# EAGLE design batsim1_2 (EAGLE 7.7.0)
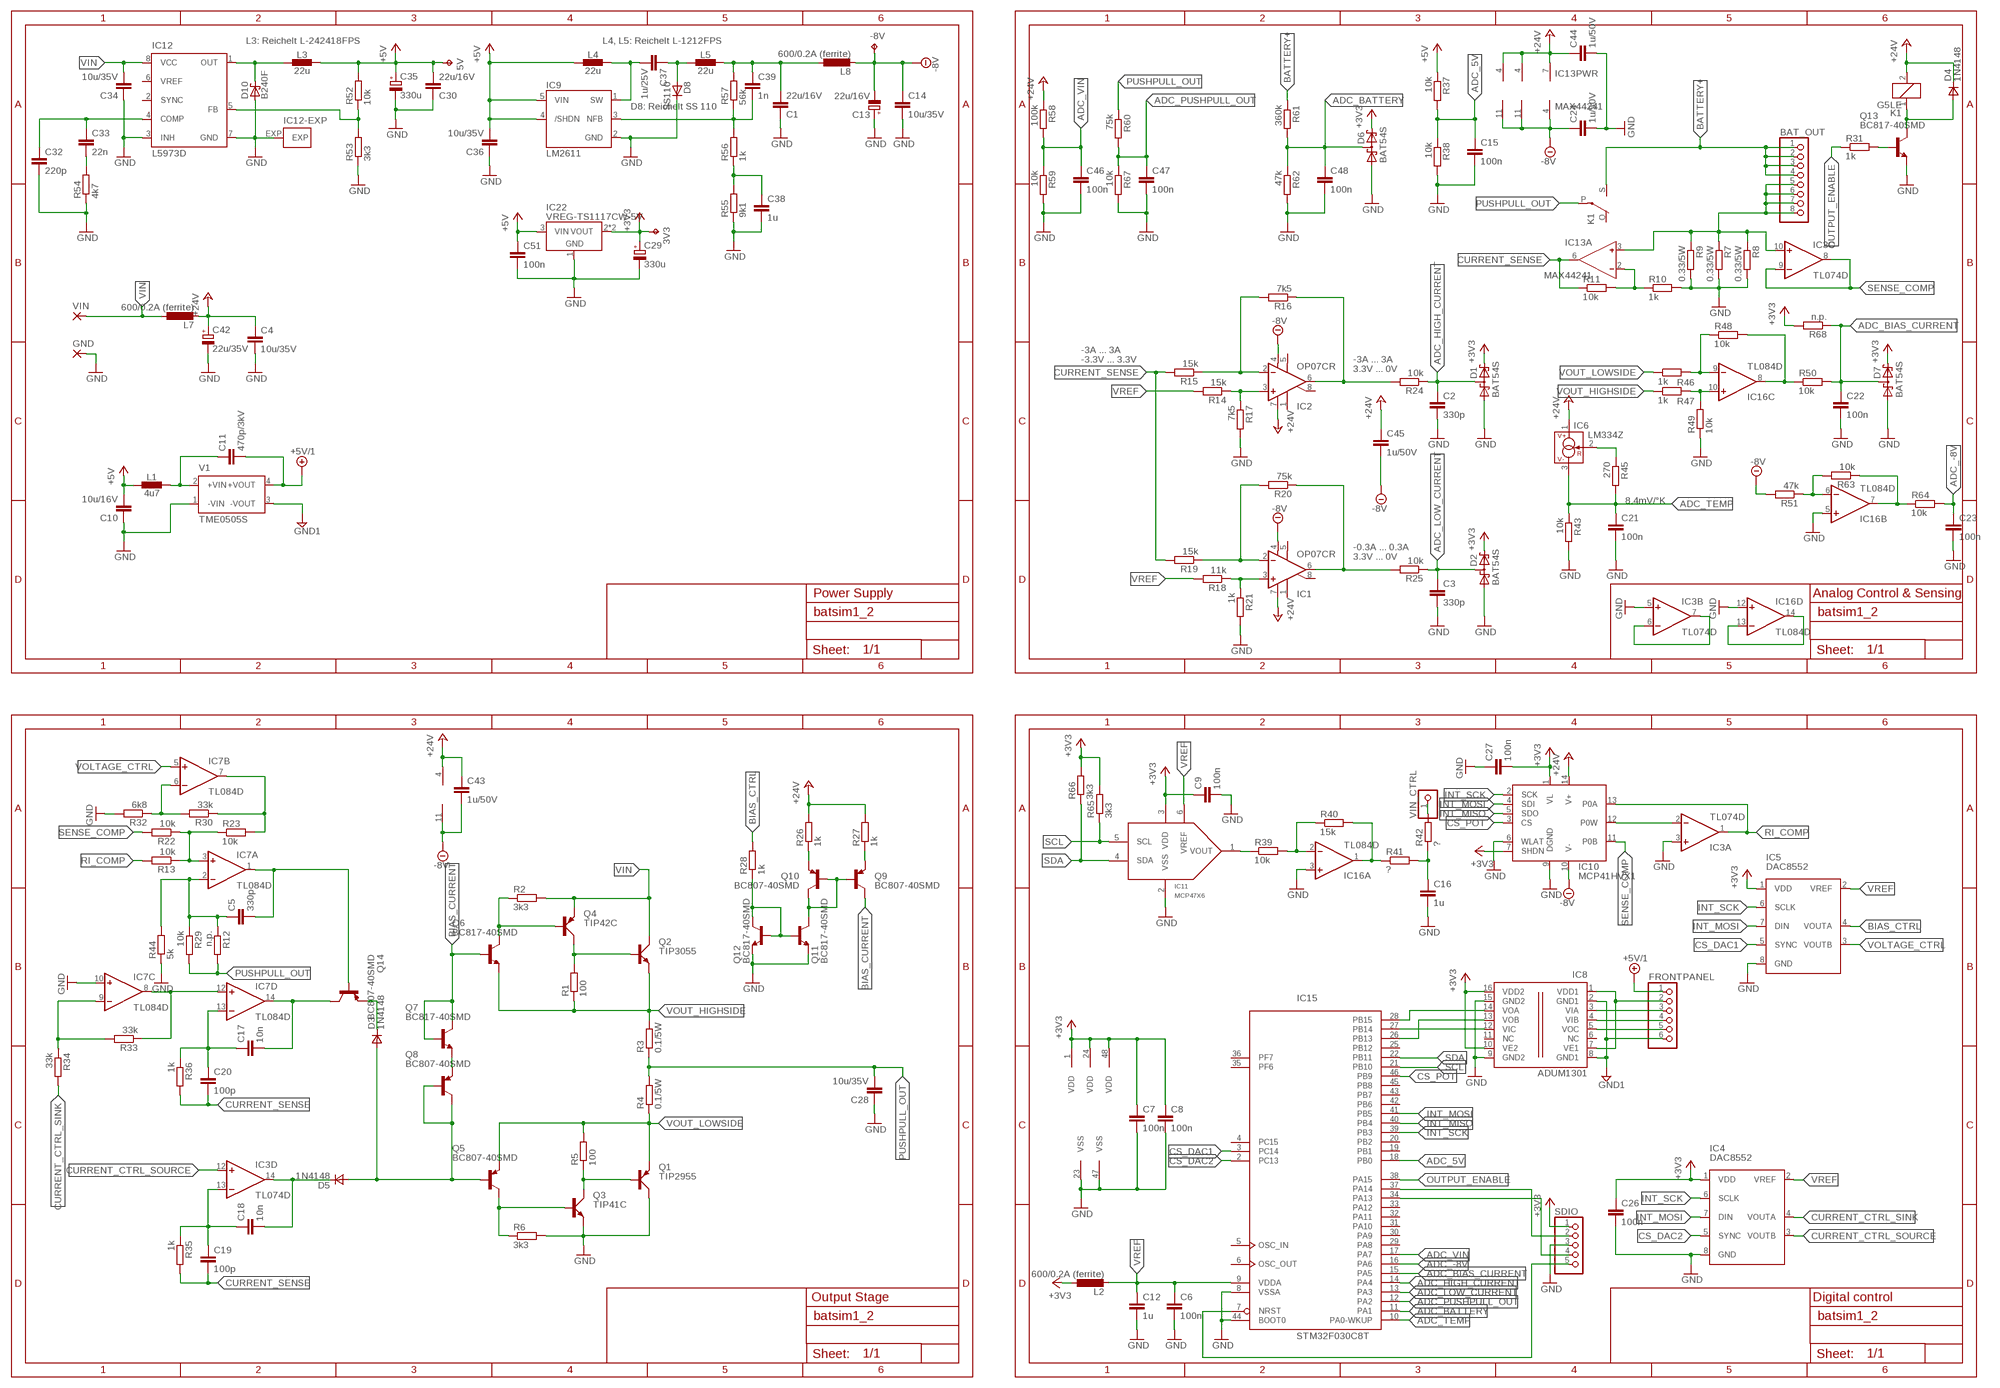
[diagram p0: schematic, sheet 1]

## Parts
3V3  TPB1,27  [B1,27]
5V  TPB1,27  [B1,27]
-8V  TPB1,27  [B1,27]
BAT_OUT  PINHD-1X8/90  [1X08/90]
C1  22u/16V  C-EUC1206  [C1206]
C2  330p  C-EUC0603  [C0603]
C3  330p  C-EUC0603  [C0603]
C4  10u/35V  C-EUC1206  [C1206]
C5  330p  C-EUC0603  [C0603]
C6  100n  C-EUC0603  [C0603]
C7  100n  C-EUC0603  [C0603]
C8  100n  C-EUC0603  [C0603]
C9  100n  C-EUC0603  [C0603]
C10  10u/16V  C-EUC1206  [C1206]
C11  470p/3kV  C-EUC1812  [C1812]
C12  1u  C-EUC0603  [C0603]
C13  22u/16V  CPOL-EU153CLV-0505  [153CLV-0505]
C14  10u/35V  C-EUC1206  [C1206]
C15  100n  C-EUC0603  [C0603]
C16  1u  C-EUC0603  [C0603]
C17  10n  C-EUC0603  [C0603]
C18  10n  C-EUC0603  [C0603]
C19  100p  C-EUC0603  [C0603]
C20  100p  C-EUC0603  [C0603]
C21  100n  C-EUC0603  [C0603]
C22  100n  C-EUC0603  [C0603]
C23  100n  C-EUC0603  [C0603]
C24  1u/50V  C-EUC0603  [C0603]
C26  100n  C-EUC0603  [C0603]
C27  100n  C-EUC0603  [C0603]
C28  10u/35V  C-EUC1206  [C1206]
C29  330u  CPOL-EU153CLV-0605  [153CLV-0605]
C30  22u/16V  C-EUC1206  [C1206]
C32  220p  C-EUC0603  [C0603]
C33  22n  C-EUC0603  [C0603]
C34  10u/35V  C-EUC1206  [C1206]
C35  330u  CPOL-EU153CLV-0605  [153CLV-0605]
C36  10u/35V  C-EUC1206  [C1206]
C37  1u/25V  C-EUC1206  [C1206]
C38  1u  C-EUC0603  [C0603]
C39  1n  C-EUC0603  [C0603]
C42  22u/35V  CPOL-EU153CLV-0605  [153CLV-0605]
C43  1u/50V  C-EUC0603  [C0603]
C44  1u/50V  C-EUC0603  [C0603]
C45  1u/50V  C-EUC0603  [C0603]
C46  100n  C-EUC0603  [C0603]
C47  100n  C-EUC0603  [C0603]
C48  100n  C-EUC0603  [C0603]
C51  100n  C-EUC0603  [C0603]
D1  BAT54S  [SOT23]
D2  BAT54S  [SOT23]
D3  1N4148  DSOD323  [SOD323]
D4  1N4148  DSOD323  [SOD323]
D5  1N4148  DSOD323  [SOD323]
D6  BAT54S  [SOT23]
D7  BAT54S  [SOT23]
D8  SS110  D-SMA  [SMA]
D10  B240F  SCHOTTKY-DIODESMD  [SMB]
FRONTPANEL  PINHD-1X6/90  [1X06/90]
GND  3,81/1,4  [3,81/1,4]
IC1  OP07CR  [SO08]
IC2  OP07CR  [SO08]
IC3  TL074D  [SO14]
IC4  DAC8552  [MSOP8]
IC5  DAC8552  [MSOP8]
IC6  LM334Z  [TO92]
IC7  TL084D  [SO14]
IC8  ADUM1301  [SO-16W]
IC9  LM2611  [SOT23-5]
IC10  MCP41HVX1  [TSSOP14]
IC11  MCP47X6  [SOT23-6L]
IC12  L5973D  [HSOP8]
IC13  MAX44241  [UMAX8]
IC15  STM32F030C8T  [LQFP48]
IC16  TL084D  [SO14]
IC22  VREG-TS1117CW-5V  [SOT223]
K1  G5LE  [G5LE]
L1  4u7  INDUCTOR-1212  [L_1212]
L2  600/0.2A (ferrite)  L-EUL2012C  [L2012C]
L3  22u  INDUCTOR-NR60XX  [L_NR60XX]
L4  22u  INDUCTOR-1212  [L_1212]
L5  22u  INDUCTOR-1212  [L_1212]
L7  600/0.2A (ferrite)  L-EUL2012C  [L2012C]
L8  600/0.2A (ferrite)  L-EUL2012C  [L2012C]
Q1  TIP2955  [TOP3AV]
Q2  TIP3055  [TOP3AV]
Q3  TIP41C  [TO220AV]
Q4  TIP42C  [TO220AV]
Q5  BC807-40SMD  [SOT23-BEC]
Q6  BC817-40SMD  [SOT23-BEC]
Q7  BC817-40SMD  [SOT23-BEC]
Q8  BC807-40SMD  [SOT23-BEC]
Q9  BC807-40SMD  [SOT23-BEC]
Q10  BC807-40SMD  [SOT23-BEC]
Q11  BC817-40SMD  [SOT23-BEC]
Q12  BC817-40SMD  [SOT23-BEC]
Q13  BC817-40SMD  [SOT23-BEC]
Q14  BC807-40SMD  [SOT23-BEC]
R1  100  R-EU_R0603  [R0603]
R2  3k3  R-EU_R0603  [R0603]
R3  0.1/5W  5WAXIAL  [5WAXIAL]
R4  0.1/5W  5WAXIAL  [5WAXIAL]
R5  100  R-EU_R0603  [R0603]
R6  3k3  R-EU_R0603  [R0603]
R7  0.33/5W  5WAXIAL  [5WAXIAL]
R8  0.33/5W  5WAXIAL  [5WAXIAL]
R9  0.33/5W  5WAXIAL  [5WAXIAL]
R10  1k  R-EU_R0603  [R0603]
R11  10k  R-EU_R0603  [R0603]
R12  n.p.  R-EU_R0603  [R0603]
R13  10k  R-EU_R0603  [R0603]
R14  15k  R-EU_R0603  [R0603]
R15  15k  R-EU_R0603  [R0603]
R16  7k5  R-EU_R0603  [R0603]
R17  7k5  R-EU_R0603  [R0603]
R18  11k  R-EU_R0603  [R0603]
R19  15k  R-EU_R0603  [R0603]
R20  75k  R-EU_R0603  [R0603]
R21  1k  R-EU_R0603  [R0603]
R22  10k  R-EU_R0603  [R0603]
R23  10k  R-EU_R0603  [R0603]
R24  10k  R-EU_R0603  [R0603]
R25  10k  R-EU_R0603  [R0603]
R26  1k  R-EU_R0603  [R0603]
R27  1k  R-EU_R0603  [R0603]
R28  1k  R-EU_R0603  [R0603]
R29  10k  R-EU_R0603  [R0603]
R30  33k  R-EU_R0603  [R0603]
R31  1k  R-EU_R0603  [R0603]
R32  6k8  R-EU_R0603  [R0603]
R33  33k  R-EU_R0603  [R0603]
R34  33k  R-EU_R0603  [R0603]
R35  1k  R-EU_R0603  [R0603]
R36  1k  R-EU_R0603  [R0603]
R37  10k  R-EU_R0603  [R0603]
R38  10k  R-EU_R0603  [R0603]
R39  10k  R-EU_R0603  [R0603]
R40  15k  R-EU_R0603  [R0603]
R41  ?  R-EU_R0603  [R0603]
R42  ?  R-EU_R0603  [R0603]
R43  10k  R-EU_R0603  [R0603]
R44  5k  R-EU_R0603  [R0603]
R45  270  R-EU_R0603  [R0603]
R46  1k  R-EU_R0603  [R0603]
R47  1k  R-EU_R0603  [R0603]
R48  10k  R-EU_R0603  [R0603]
R49  10k  R-EU_R0603  [R0603]
R50  10k  R-EU_R0603  [R0603]
R51  47k  R-EU_R0603  [R0603]
R52  10k  R-EU_R0603  [R0603]
R53  3k3  R-EU_R0603  [R0603]
R54  4k7  R-EU_R0603  [R0603]
R55  9k1  R-EU_R0603  [R0603]
R56  1k  R-EU_R0603  [R0603]
R57  56k  R-EU_R0603  [R0603]
R58  100k  R-EU_R0603  [R0603]
R59  10k  R-EU_R0603  [R0603]
R60  75k  R-EU_R0603  [R0603]
R61  360k  R-EU_R0603  [R0603]
R62  47k  R-EU_R0603  [R0603]
R63  10k  R-EU_R0603  [R0603]
R64  10k  R-EU_R0603  [R0603]
R65  3k3  R-EU_R0603  [R0603]
R66  3k3  R-EU_R0603  [R0603]
R67  10k  R-EU_R0603  [R0603]
R68  n.p.  R-EU_R0603  [R0603]
SDIO  PINHD-1X5  [1X05]
V1  TME0505S  [TME]
VIN  3,81/1,4  [3,81/1,4]
VIN_CTRL  PINHD-1X1  [1X01]

## Nets
+3V3: 3V3.TP C7.1 C8.1 C9.1 C26.1 C27.2 C29.+ D1.2(C2) D2.2(C2) D6.2(C2) D7.2(C2) IC4.1(VDD) IC5.1(VDD) IC8.10(VE2) IC8.16(VDD2) IC10.1(VL) IC10.7(SHDN) IC11.3(VDD) IC15.1(VDD) IC15.24(VDD) IC15.48(VDD) IC22.2(VOUT) IC22.4(VOUT) L2.1 R65.2 R66.2 R68.2 SDIO.1
+5V: 5V.TP C10.2 C30.2 C35.+ C36.2 C51.1 IC9.4(/SHDN) IC9.5(VIN) IC22.3(VIN) L1.1 L3.2 L4.1 R37.1 R52.2
+5V/1: C11.2 FRONTPANEL.1 V1.4(+VOUT)
+24V: C4.1 C42.+ C43.1 C44.1 C45.1 D4.1(C) IC1.7(V+) IC2.7(V+) IC3.4(P:V+) IC6.1(V+) IC7.4(P:V+) IC10.14(V+) IC13.7(PWR:V+) IC16.4(P:V+) K1.2 L7.2 R26.2 R27.2 R58.1
-8V: -8V.TP C13.- C14.1 C24.1 C43.2 C45.2 IC1.4(V-) IC2.4(V-) IC3.11(P:V-) IC7.11(P:V-) IC10.10(V-) IC13.4(PWR:V-) IC16.11(P:V-) L8.2 R51.2
ADC_5V: C15.1 IC15.18(PB0) R37.2 R38.1
ADC_-8V: C23.1 IC15.16(PA6) R64.2
ADC_BATTERY: C48.1 D6.3(C1A2) IC15.11(PA1) R61.2 R62.1
ADC_BIAS_CURRENT: C22.1 D7.3(C1A2) IC15.15(PA5) R50.2 R68.1
ADC_HIGH_CURRENT: C2.1 D1.3(C1A2) IC15.14(PA4) R24.1
ADC_LOW_CURRENT: C3.1 D2.3(C1A2) IC15.13(PA3) R25.1
ADC_PUSHPULL_OUT: C47.1 IC15.12(PA2) R60.2 R67.1
ADC_TEMP: C21.1 IC6.3(V-) IC15.10(PA0-WKUP) R43.1 R45.2
ADC_VIN: C46.1 IC15.17(PA7) R58.2 R59.1
BATTERY+: BAT_OUT.1 BAT_OUT.2 BAT_OUT.3 BAT_OUT.4 K1.S(2:S) R61.1
BIAS_CTRL: IC5.4(VOUTA) R28.2
BIAS_CURRENT: Q6.B Q7.B Q7.C Q9.C
CS_DAC1: IC5.5(SYNC) IC15.3(PC14)
CS_DAC2: IC4.5(SYNC) IC15.2(PC13)
CS_POT: IC10.3(CS) IC15.46(PB9)
CURRENT_CTRL_SINK: IC4.4(VOUTA) R34.2
CURRENT_CTRL_SOURCE: IC3.12(D:+IN) IC4.3(VOUTB)
CURRENT_SENSE: C19.2 C20.2 IC13.6(A:OUT) R11.1 R15.2 R19.2 R35.2 R36.2
EXT_MISO: IC8.12(VIC) IC15.27(PB14)
EXT_MOSI: IC8.14(VOA) IC15.28(PB15)
EXT_SCK: IC8.13(VOB) IC15.26(PB13)
GND: C1.1 C2.2 C3.2 C4.2 C6.2 C7.2 C8.2 C9.2 C10.1 C12.2 C13.+ C14.2 C15.2 C16.2 C21.2 C22.2 C23.2 C24.2 C26.2 C27.1 C28.1 C29.- C30.1 C32.2 C34.1 C35.- C36.1 C38.2 C42.- C44.2 C46.2 C47.2 C48.2 C51.2 D1.1(A1) D2.1(A1) D6.1(A1) D7.1(A1) D8.C D10.A GND.1(P) IC3.3(A:+IN) IC3.5(B:+IN) IC4.8(GND) IC5.8(GND) IC7.10(C:+IN) IC8.9(GND2) IC8.15(GND2) IC9.2(GND) IC10.6(WLAT) IC10.9(DGND) IC11.2(VSS) IC12.3(INH) IC12.7(GND) IC12.EXP IC15.8(VSSA) IC15.23(VSS) IC15.44(BOOT0) IC15.47(VSS) IC16.3(A:+IN) IC16.5(B:+IN) IC16.12(D:+IN) IC22.1(GND) Q1.C Q3.E Q11.E Q12.E Q13.E R6.2 R7.2 R8.2 R9.2 R10.2 R17.2 R21.2 R32.2 R38.2 R43.2 R44.1 R49.1 R53.1 R54.1 R55.1 R59.2 R62.2 R67.2 SDIO.3 V1.1(-VIN)
GND1: FRONTPANEL.6 IC8.2(GND1) IC8.8(GND1) V1.3(-VOUT)
INT_MISO: IC10.5(SDO) IC15.40(PB4)
INT_MOSI: IC4.7(DIN) IC5.7(DIN) IC10.4(SDI) IC15.41(PB5)
INT_SCK: IC4.6(SCLK) IC5.6(SCLK) IC10.2(SCK) IC15.39(PB3)
LM2611_SW: C37.2 IC9.1(SW) L4.2
N$1: IC7.3(A:+IN) R13.1 R22.1 R23.1
N$2: Q2.B Q4.C R1.2
N$3: Q4.B Q6.C R2.1
N$4: IC7.6(B:-IN) R30.2 R32.1
N$5: BAT_OUT.5 BAT_OUT.6 BAT_OUT.7 BAT_OUT.8 IC3.10(C:+IN) IC13.3(A:IN+) R7.1 R8.1 R9.1
N$6: IC16.9(C:-IN) R46.2 R48.1
N$7: Q1.B Q3.C R5.1
N$8: C11.1 L1.2 V1.2(+VIN)
N$9: Q3.B Q5.C R6.1
N$10: Q7.E Q8.E
N$11: IC7.7(B:OUT) R23.2 R30.1
N$12: D3.1(C) Q14.E
N$13: D4.2(A) K1.1 Q13.C
N$14: IC13.2(A:IN-) R10.1 R11.2
N$15: IC3.6(B:-IN) IC3.7(B:OUT)
N$16: IC2.3(+IN) R14.1 R17.1
N$17: IC2.2(-IN) R15.1 R16.2
N$18: IC2.6(OUT) R16.1 R24.2
N$20: IC1.3(+IN) R18.1 R21.1
N$21: IC1.2(-IN) R19.1 R20.2
N$22: IC1.6(OUT) R20.1 R25.2
N$23: IC3.2(A:-IN) IC10.12(P0W)
N$24: Q9.B Q10.B Q10.C Q11.C
N$25: Q11.B Q12.B Q12.C R28.1
N$26: Q13.B R31.2
N$27: IC16.13(D:-IN) IC16.14(D:OUT)
N$28: Q10.E R26.1
N$29: Q9.E R27.1
N$30: C32.1 C33.1 IC12.4(COMP)
N$31: C5.2 IC7.1(A:OUT) Q14.B
N$35: IC11.1(VOUT) R39.1
N$36: IC7.9(C:-IN) R33.2 R34.1
N$37: IC7.8(C:OUT) IC7.12(D:+IN) R33.1
N$38: C18.2 D5.1(C) IC3.14(D:OUT)
N$39: C18.1 C19.1 IC3.13(D:-IN) R35.1
N$40: C17.2 IC7.14(D:OUT) Q14.C
N$41: IC16.2(A:-IN) R39.2 R40.1
N$42: C17.1 C20.1 IC7.13(D:-IN) R36.1
N$43: IC16.1(A:OUT) R40.2 R41.1
N$44: C16.1 R41.2 R42.1
N$45: FRONTPANEL.2 IC8.1(VDD1) IC8.7(VE1)
N$46: FRONTPANEL.3 IC8.3(VIA)
N$47: FRONTPANEL.4 IC8.4(VIB)
N$48: FRONTPANEL.5 IC8.5(VOC)
N$49: C33.2 R54.2
N$50: IC16.10(C:+IN) R47.2 R49.2
N$51: IC6.2(R) R45.1
N$52: D10.C IC12.1(OUT) L3.1
N$53: C1.2 C39.1 L5.2 L8.1 R57.2
N$54: IC12.5(FB) R52.1 R53.2
N$55: IC16.8(C:OUT) R48.2 R50.1
N$56: C37.1 D8.A L5.1
N$57: C39.2 IC9.3(NFB) R56.2 R57.1
N$58: C38.1 R55.2 R56.1
N$59: IC16.6(B:-IN) R51.1 R63.2
N$60: IC16.7(B:OUT) R63.1 R64.1
NRST: IC15.7(NRST) SDIO.5
OUTPUT_ENABLE: IC15.38(PA15) R31.1
PUSHPULL_CTRL: D3.2(A) D5.2(A) Q5.B Q8.B Q8.C
PUSHPULL_OUT: C28.2 K1.P(2:P) R3.1 R4.2 R12.2 R29.2 R60.1
RI_COMP: IC3.1(A:OUT) IC10.13(P0A) R13.2
SCL: IC11.5(SCL) IC15.21(PB10) R65.1
SDA: IC11.4(SDA) IC15.22(PB11) R66.1
SENSE_COMP: IC3.8(C:OUT) IC3.9(C:-IN) IC10.11(P0B) R22.2
SWCLK: IC15.37(PA14) SDIO.2
SWDIO: IC15.34(PA13) SDIO.4
VIN: C34.2 IC12.8(VCC) L7.1 Q2.C Q4.E R2.2 VIN.1(P)
VIN_CTRL: R42.2 VIN_CTRL.1
VOLTAGE_CTRL: IC5.3(VOUTB) IC7.5(B:+IN)
VOLTAGE_FEEDBACK: C5.1 IC7.2(A:-IN) R12.1 R29.1 R44.2
VOUT_HIGHSIDE: Q2.E Q6.E R1.1 R3.2 R47.1
VOUT_LOWSIDE: Q1.E Q5.E R4.1 R5.2 R46.1
VREF: C6.1 C12.1 IC4.2(VREF) IC5.2(VREF) IC11.6(VREF) IC15.9(VDDA) L2.2 R14.2 R18.2
Unconnected: IC1.1(ON1) IC1.5(OPT) IC1.8(ON2) IC2.1(ON1) IC2.5(OPT) IC2.8(ON2) IC8.6(NC) IC8.11(NC) IC12.2(SYNC) IC12.6(VREF) IC15.4(PC15) IC15.5(OSC_IN) IC15.6(OSC_OUT) IC15.19(PB1) IC15.20(PB2) IC15.25(PB12) IC15.29(PA8) IC15.30(PA9) IC15.31(PA10) IC15.32(PA11) IC15.33(PA12) IC15.35(PF6) IC15.36(PF7) IC15.42(PB6) IC15.43(PB7) IC15.45(PB8) K1.O(2:O)

## Notes on the sheet
- L3: Reichelt L-242418FPS | L4, L5: Reichelt L-1212FPS
- D8: Reichelt SS 110
- -3A ... 3A
  -3.3V ... 3.3V
- -3A ... 3A
  3.3V ... 0V
- 8.4mV/°K
- -0.3A ... 0.3A
  3.3V ... 0V
- Power Supply | Analog Control & Sensing
- Output Stage | Digital control

## Library data of the parts
3V3 5V -8V = testpad:TP: Test pad
BAT_OUT = pinhead:PINHD-1X8: PIN HEADER
C1-C10 C12 C14-C24 C26-C28 C30 C32-C34 C36-C39 C43-C48 C51 = rcl:C-EU: CAPACITOR, European symbol
C11 = resistor:C-EU: CAPACITOR, European symbol
C13 C29 C35 C42 = resistor:CPOL-EU: POLARIZED CAPACITOR, European symbol
D1 D2 D6 D7 = diode:BAT54S: Schottky Diodes Pin connection corrected 2011-05-04 Source: Fairchild .. BAT54.pdf
D3-D5 = zetex:D: DIODE; MPN: CDSOD323-T05C; OC_FARNELL: 1824860; OC_NEWARK: 79R6078
D8 = diodes:D-: DIODE
D10 = diode:SCHOTTKY-DIODE: Schottky Diode
FRONTPANEL = pinhead:PINHD-1X6: PIN HEADER
GND VIN = wirepad:3,81/1,4: THROUGH-HOLE PAD
IC1 IC2 = linear:OP07*: OP AMP
IC3 = linear:TL074: OP AMP
IC4 IC5 = dac:DAC8552
IC6 = linear:LM*34: 3-Terminal Adjustable Current Sources Source: www.national.com/pf/LM/LM334.html | LM134.pdf
IC7 IC16 = linear:TL084: OP AMP
IC8 = analog-devices:ADUM1301: Triple-Channel Digital Isolators Source: http://www.analog.com/static/imported-files/data_sheets/ADuM1300_1301.pdf; MPN: ADUM1301BRWZ; OC_FARNELL: 1465623; OC_NEWARK: 19M0757
IC9 = v-reg-3:LM2611
IC10 = mcp:MCP41HVX1
IC11 = dac:MCP47X6
IC12 = st-microelectronics:L5973D: 2.5 A switch step down switching regulator Source: Data sheet <http://www.st.com/internet/com/TECHNICAL_RESOURCES/TECHNICAL_LITERATURE/DATASHEET/CD00002851.pdf>; MF: STMICROELECTRONICS; MPN: L5973D; OC_FARNELL: 1077145
IC13 = custom-op:MAX44241
IC15 = micro-stm_v3:STM32F030C*T: ARM 32-bit Cortex™-M0 CPU 48 MHz maximum frequency 32 to 64 Kbytes of Flash memory 4 to 8 kbytes of SRAM 39 GPIOs 2.4 to 3.6 V application supply
IC22 = we-power:VREG: Voltage Regulators (LDOs, Switching Converters...) LDOs Taiwan Semi TS1117 800mA max 15V - compatible On Semi NCP1117 1A max 20V - compatible Diodes AP2111H 0.6A max 6V (0.25V@0.6A) - compatible Diodes AP2114H 1A max 6V (0.45V@1A) Taiwan Semi TS9011 250mA max 12V - compatible Diodes AP2210 300mA max 15V - compatible Microchip MCP1700 250mA max 6.5V - compatible Microchip MCP1702 250mA max 13V - compatible Microchip MCP1703 250mA max 16V - compatible Microchip MCP1754 150mA max 16V Taiwan Semi TS5204 150mA max 16V (low noise) DC/DC Converter Modules Recom R-78Ex.x-1.0-W36 1A max 28V - compatible CUI V78xx-2000 2A max 18V Murata OKI-78SR-x.x/1.5-W36 1.5A max 36V
K1 = relay:G5LE: RELAY 1 x switch, 10 A/120 V AC, 8 A/30 V DC, Omron; OC_FARNELL: unknown; OC_NEWARK: unknown
L1 L3-L5 = we-power:INDUCTOR: Power Inductors Taiyo Yuden NR6028 NR6028T0R9N - 0.9uH, Ir=6.6A NR6028T1R5N - 1.5uH, Ir=5.0A NR6028T2R2N - 2.2uH, Ir=4.2A NR6028T3R0N - 3.0uH, Ir=3.6A NR6028T4R7M - 4.7uH, Ir=2.7A NR6028T6R0M - 6.0uH, Ir=2.5A NR6028T100M - 10uH, Ir=1.9A NR6028T150M - 15uH, Ir=1.6A NR6028T220M - 22uH, Ir=1.3A NR6028T330M - 33uH, Ir=1.1A NR6028T470M - 47uH, Ir=0.95A NR6028T680M - 68uH, Ir=0.76A NR6028T101M - 100uH, Ir=0.62A Taiyo Yuden NR6045 NR6045T1R0N - 1.0uH, Ir=8.5A NR6045T1R3N - 1.3uH, Ir=8.0A NR6045T1R8N - 1.8uH, Ir=7.0A NR6045T2R3N - 2.3uH, Ir=6.0A NR6045T3R0N - 3.0uH, Ir=5.0A NR6045T4R5M - 4.5uH, Ir=4.0A NR6045T6R3M - 6.3uH, Ir=3.8A NR6045T100M - 10uH, Ir=3.0A NR6045T150M - 15uH, Ir=2.3A NR6045T220M - 22uH, Ir=1.9A NR6045T330M - 33uH, Ir=1.5A NR6045T470M - 47uH, Ir=1.3A NR6045T680M - 68uH, Ir=1.0A NR6045T101M - 100uH, Ir=0.8A
L2 L7 L8 = rcl:L-EU: INDUCTOR, European symbol
Q1 = transistor-power:TIP2955: PNP TRANSISTOR
Q2 = transistor-power:TIP3055: NPN TRANSISTOR
Q3 = transistor-power:TIP41C: NPN TRANSISTOR
Q4 = transistor-power:TIP42C: PNP TRANSISTOR
Q5 Q8-Q10 Q14 = transistor-pnp:BC807*: PNP Transistror
Q6 Q7 Q11-Q13 = transistor-npn:BC817*: NPN Transistor
R1 R2 R5 R6 R10-R68 = resistor:R-EU_: RESISTOR, European symbol
R3 R4 R7-R9 = resistormod:5WAXIAL
SDIO = pinhead:PINHD-1X5: PIN HEADER
V1 = traco-electronic:TME?*: DC/DC Converter TME Series 1 Watt Source: www.tracopower.com .. tme.pdf; MPN: TME 0505S; OC_FARNELL: 1007538; OC_NEWARK: 51R5321
VIN_CTRL = pinhead:PINHD-1X1: PIN HEADER

## Board
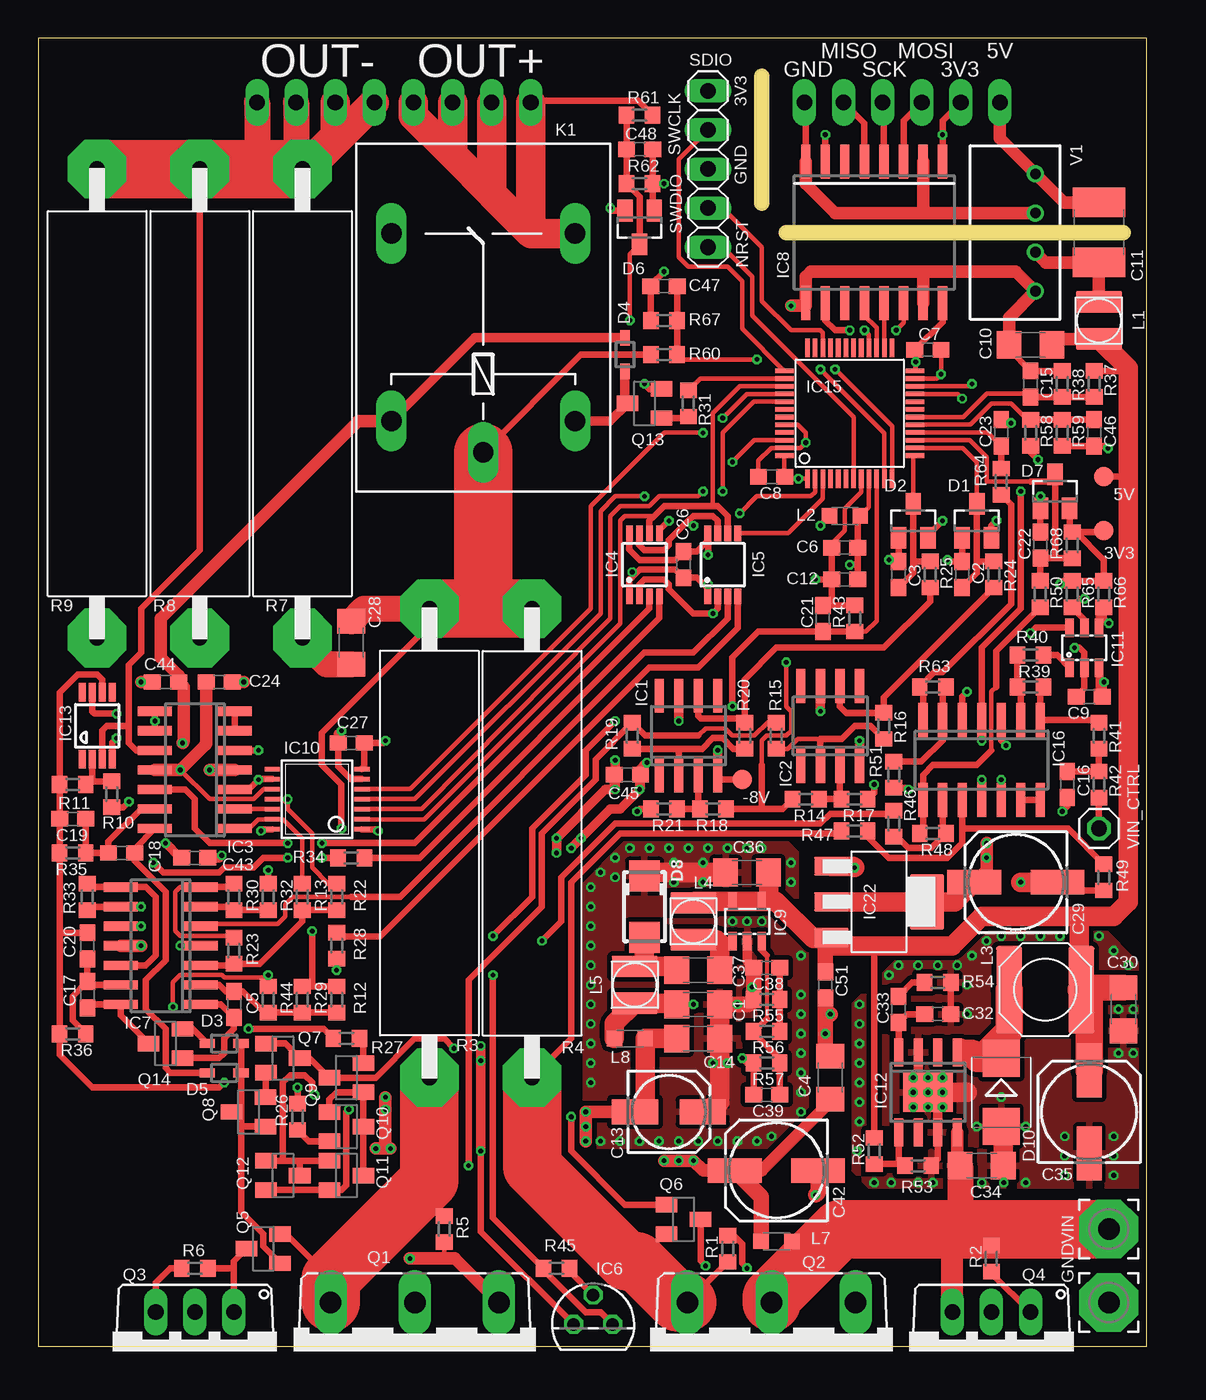
[diagram p1: board, top side]
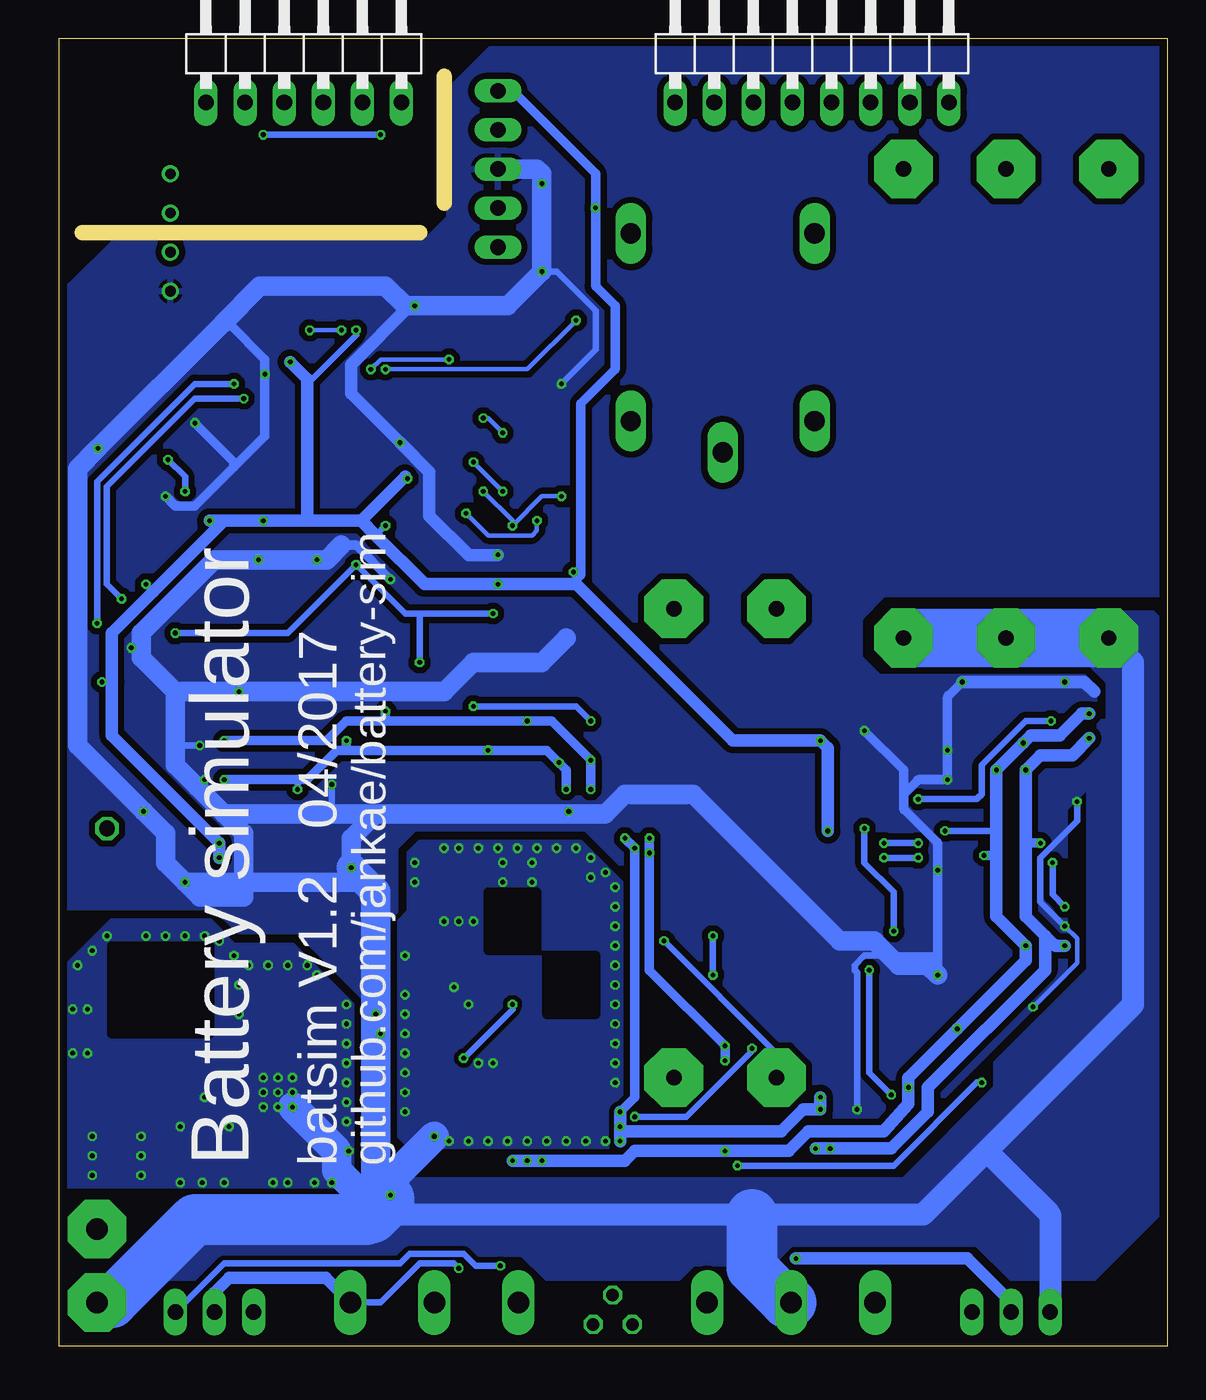
[diagram p2: board, bottom side, seen from below]

Size 72 x 85 mm. Coordinates in mm from the lower left corner, seen from the top.
Outline: 0,0 72,0 72,85 0,85 0,0
Copper layers (1*16): Top 0.035mm / dielectric 1.6mm / Bottom 0.035mm
Design rules "Elecrow_2-layer_PCB_eagle_rule": minimum track width 6mil, minimum drill 12mil, track to track 6mil, track to pad 6mil, pad to pad 6mil, via to via 8mil, smd to smd 0mil, copper to edge 20mil, drill to drill 10mil, minimum pad ring 6mil, minimum via ring 6mil, stop-mask expansion 0mil, vias tented up to drill 100mil, thermal gap 10mil
tRestrict: area 64.1,20.3 to 66.7,26
bRestrict: area 62.2,20.3 to 68.6,26; area 41,25.7 to 44.1,29.5; area 37.1,21.6 to 40.3,25.4
Milling: 2 lines

### Footprints (pad centres in the part's own frame; a part is rotated, then mirrored left to right if it is on the bottom)
B1,27 = smd 1.27 x 1.27: TP 0,0
1X08/90 = drill 1.016 long: 1 -8.89,-3.81; 2 -6.35,-3.81; 3 -3.81,-3.81; 4 -1.27,-3.81; 5 1.27,-3.81; 6 3.81,-3.81; 7 6.35,-3.81; 8 8.89,-3.81
C1206 = smd 1.6 x 1.8: 1 -1.4,0; 2 1.4,0
C0603 = smd 1.1 x 1: 1 -0.85,0; 2 0.85,0
C1812 = smd 1.9 x 3.4: 1 -1.95,0; 2 1.95,0
153CLV-0505 = smd 3 x 1.6: + 2.2,0; - -2.2,0
153CLV-0605 = smd 3.5 x 1.6: + 2.7,0; - -2.7,0
SOT23 = smd 1 x 1.4: 1 -0.95,-1.1; 2 0.95,-1.1; 3 0,1.1
SOD323 = smd 1 x 0.6: 1 -1.1,0; 2 1.1,0
SMA = smd 2 x 2: A 2,0; C -2,0
SMB = smd 2.4 x 2.4: A 2.2,0; C -2.2,0
1X06/90 = drill 1.016 long: 1 -6.35,-3.81; 2 -3.81,-3.81; 3 -1.27,-3.81; 4 1.27,-3.81; 5 3.81,-3.81; 6 6.35,-3.81
3,81/1,4 = drill 1.397 pad 3.81 octagon: 1 0,0
SO08 = smd 0.6 x 2.2: 1 -1.905,-2.6; 2 -0.635,-2.6; 3 0.635,-2.6; 4 1.905,-2.6; 5 1.905,2.6; 6 0.635,2.6; 7 -0.635,2.6; 8 -1.905,2.6
SO14 = smd 0.6 x 2.2: 1 -3.81,-2.6; 2 -2.54,-2.6; 3 -1.27,-2.6; 4 0,-2.6; 5 1.27,-2.6; 6 2.54,-2.6; 7 3.81,-2.6; 8 3.81,2.6; 9 2.54,2.6; 10 1.27,2.6; 11 0,2.6; 12 -1.27,2.6; 13 -2.54,2.6; 14 -3.81,2.6
MSOP8 = smd 0.45 x 1: 1 -0.975,-2.05; 2 -0.325,-2.05; 3 0.325,-2.05; 4 0.975,-2.05; 5 0.975,2.05; 6 0.325,2.05; 7 -0.325,2.05; 8 -0.975,2.05
TO92 = drill 0.813 octagon: 1 -1.27,0; 2 0,1.905; 3 1.27,0
SO-16W = smd 0.6 x 2.2: 1 -4.445,-4.6; 2 -3.175,-4.6; 3 -1.905,-4.6; 4 -0.635,-4.6; 5 0.635,-4.6; 6 1.905,-4.6; 7 3.175,-4.6; 8 4.445,-4.6; 9 4.445,4.6; 10 3.175,4.6; 11 1.905,4.6; 12 0.635,4.6; 13 -0.635,4.6; 14 -1.905,4.6; 15 -3.175,4.6; 16 -4.445,4.6
SOT23-5 = smd 0.55 x 1.2: 1 -0.95,-1.3; 2 0,-1.3; 3 0.95,-1.3; 4 0.95,1.3; 5 -0.95,1.3
TSSOP14 = smd 0.305 x 0.991: 1 -1.95,-2.918; 2 -1.3,-2.918; 3 -0.65,-2.918; 4 0,-2.918; 5 0.65,-2.918; 6 1.3,-2.918; 7 1.95,-2.918; 8 1.95,2.918; 9 1.3,2.918; 10 0.65,2.918; 11 0,2.918; 12 -0.65,2.918; 13 -1.3,2.918; 14 -1.95,2.918
SOT23-6L = smd 0.55 x 1.2: 1 -0.95,-1.3; 2 0,-1.3; 3 0.95,-1.3; 4 0.95,1.3; 5 0,1.3; 6 -0.95,1.3
HSOP8 = smd 0.6 x 1.8: 1 -1.905,-2.6; 2 -0.635,-2.6; 3 0.635,-2.6; 4 1.905,-2.6; 5 1.905,2.6; 6 0.635,2.6; 7 -0.635,2.6; 8 -1.905,2.6 | smd 3.2 x 2.51: EXP 0,0
UMAX8 = smd 0.45 x 1.2: 1 -0.975,-2.175; 2 -0.325,-2.175; 3 0.325,-2.175; 4 0.975,-2.175; 5 0.975,2.175; 6 0.325,2.175; 7 -0.325,2.175; 8 -0.975,2.175
LQFP48 = smd 0.3 x 1.2: 1 -2.75,-4.25; 2 -2.25,-4.25; 3 -1.75,-4.25; 4 -1.25,-4.25; 5 -0.75,-4.25; 6 -0.25,-4.25; 7 0.25,-4.25; 8 0.75,-4.25; 9 1.25,-4.25; 10 1.75,-4.25; 11 2.25,-4.25; 12 2.75,-4.25; 25 2.75,4.25; 26 2.25,4.25; 27 1.75,4.25; 28 1.25,4.25; 29 0.75,4.25; 30 0.25,4.25; 31 -0.25,4.25; 32 -0.75,4.25; 33 -1.25,4.25; 34 -1.75,4.25; 35 -2.25,4.25; 36 -2.75,4.25 | smd 1.2 x 0.3: 13 4.25,-2.75; 14 4.25,-2.25; 15 4.25,-1.75; 16 4.25,-1.25; 17 4.25,-0.75; 18 4.25,-0.25; 19 4.25,0.25; 20 4.25,0.75; 21 4.25,1.25; 22 4.25,1.75; 23 4.25,2.25; 24 4.25,2.75; 37 -4.25,2.75; 38 -4.25,2.25; 39 -4.25,1.75; 40 -4.25,1.25; 41 -4.25,0.75; 42 -4.25,0.25; 43 -4.25,-0.25; 44 -4.25,-0.75; 45 -4.25,-1.25; 46 -4.25,-1.75; 47 -4.25,-2.25; 48 -4.25,-2.75
SOT223 = smd 2.235 x 1.219: 1 -3.099,2.311; 2 -3.099,0; 3 -3.099,-2.311 | smd 2.2 x 3.6: 4 3.099,0
G5LE = drill 1.321 long: 1 -7.493,-5.969; 2 -7.493,5.969; O 4.699,5.969; P -9.525,0; S 4.699,-5.969
L_1212 = smd 3 x 1.4: 1 0,1.2; 2 0,-1.2
L2012C = smd 1 x 1: 1 -1,0; 2 1,0
L_NR60XX = smd 5.7 x 1.7: 1 0,2.35; 2 0,-2.35
TOP3AV = drill 1.397 long: B -5.461,-3.175; C 0,-3.175; E 5.461,-3.175
TO220AV = drill 1.016 long: B -2.54,-2.54; C 0,-2.54; E 2.54,-2.54
SOT23-BEC = smd 1 x 1.4: B -0.95,-1.1; C 0,1.1; E 0.95,-1.1
R0603 = smd 1 x 1.1: 1 -0.85,0; 2 0.85,0
5WAXIAL = drill 1 pad 3.81 octagon: 1 15.24,0; 2 -15.24,0
1X05 = drill 1.016 long: 1 -5.08,0; 2 -2.54,0; 3 0,0; 4 2.54,0; 5 5.08,0
TME = drill 0.7 pad 1.1: 1 -3.81,0; 2 -1.27,0; 3 1.27,0; 4 3.81,0
1X01 = drill 1.016 octagon: 1 0,0

### Placement (x,y rotation side)
3V3  69.22,53.02 0 top
5V  69.22,56.52 0 top
-8V  45.72,36.83 0 top
BAT_OUT  23.09,84.65 0 bottom
C1  42.86,22.23 180 top
C2  60.01,50.16 90 top
C3  55.88,50.16 90 top
C4  51.44,17.46 90 top
C5  12.7,22.23 270 top
C6  52.39,51.91 180 top
C7  57.78,64.77 0 top
C8  47.62,56.52 180 top
C9  68.26,42.23 180 top
C10  64.45,65.09 0 top
C11  68.9,72.39 90 top
C12  52.39,49.85 180 top
C13  40.96,15.24 0 top
C14  42.86,20 0 top
C15  64.45,62.55 90 top
C16  66.83,36.51 270 top
C17  3.17,22.86 270 top
C18  5.4,32.07 0 top
C19  2.22,34.29 180 top
C20  3.17,26.04 90 top
C21  50.96,47.31 90 top
C22  65.09,52.07 90 top
C23  62.55,59.37 90 top
C24  11.75,43.18 0 top
C26  41.91,50.8 90 top
C27  20.32,39.21 0 top
C28  20.32,45.72 90 top
C29  63.5,30.16 180 top
C30  70.48,21.91 90 top
C32  58.42,21.59 0 top
C33  55.88,21.91 90 top
C34  61.28,11.75 180 top
C35  68.26,15.24 90 top
C36  46.04,30.8 0 top
C37  42.86,24.45 0 top
C38  47.31,24.61 180 top
C39  47.31,16.35 0 top
C42  47.94,11.43 180 top
C43  10.16,31.75 180 top
C44  8.26,43.18 180 top
C45  38.26,37.15 0 top
C46  68.58,59.37 270 top
C47  40.64,68.9 180 top
C48  39.05,77.79 0 top
C51  51.12,23.5 270 top
D1  60.96,53.66 0 top
D2  56.83,53.66 0 top
D3  12.06,19.68 0 top
D4  38.1,64.45 270 top
D5  12.06,17.78 0 top
D6  39.05,72.71 180 top
D7  66.04,55.56 0 top
D8  39.37,28.57 270 top
D10  62.55,16.51 270 top
FRONTPANEL  56.11,84.65 0 bottom
GND  69.53,2.86 0 top
IC1  42.23,39.69 0 top
IC2  51.44,40.32 0 top
IC3  10.16,37.47 90 top
IC4  39.37,50.8 0 top
IC5  44.45,50.8 0 top
IC6  36.04,1.43 0 top
IC7  7.94,26.04 90 top
IC8  54.29,72.39 180 top
IC9  46.04,27.62 0 top
IC10  18.1,35.56 90 top
IC11  67.94,45.4 0 top
IC12  57.78,16.51 180 top
IC13  3.81,40.32 0 top
IC15  52.7,60.64 0 top
IC16  61.28,38.1 180 top
IC22  54.61,28.89 0 top
K1  28.89,67.63 90 top
L1  68.9,66.67 180 top
L2  52.39,53.98 0 top
L3  65.41,23.18 90 top
L4  42.55,27.62 0 top
L5  38.73,23.5 0 top
L7  47.94,6.83 180 top
L8  38.42,20 0 top
Q1  24.45,-0.32 180 top
Q2  47.62,-0.32 180 top
Q3  10.16,-0.32 180 top
Q4  61.91,-0.32 180 top
Q5  14.61,6.35 90 top
Q6  41.91,8.26 270 top
Q7  15.88,18.73 270 top
Q8  13.65,15.24 90 top
Q9  20,17.46 90 top
Q10  20,14.29 270 top
Q11  20,11.11 270 top
Q12  15.88,11.11 270 top
Q13  39.37,61.28 90 top
Q14  8.26,19.68 90 top
R1  44.77,6.35 90 top
R2  61.91,5.71 90 top
R3  32.07,32.7 90 top
R4  25.4,32.7 270 top
R5  26.35,7.62 90 top
R6  10.16,5.08 180 top
R7  17.14,61.28 90 top
R8  10.48,61.28 90 top
R9  3.81,61.28 90 top
R10  4.76,35.88 270 top
R11  2.22,36.51 0 top
R12  19.37,22.54 90 top
R13  17.14,29.21 90 top
R14  49.85,35.56 180 top
R15  47.94,39.69 90 top
R16  54.93,40.32 270 top
R17  53.02,35.56 0 top
R18  43.81,34.92 0 top
R19  38.58,39.69 90 top
R20  45.88,39.69 270 top
R21  40.64,34.92 180 top
R22  19.37,29.21 90 top
R23  12.7,25.72 90 top
R24  62.07,50.16 270 top
R25  57.94,50.16 270 top
R26  16.83,14.92 90 top
R27  20,20 180 top
R28  19.37,26.04 90 top
R29  17.14,22.54 90 top
R30  12.7,29.21 270 top
R31  42.23,61.28 270 top
R32  14.92,29.21 90 top
R33  3.17,29.21 270 top
R34  20.32,31.75 0 top
R35  2.22,32.07 180 top
R36  2.22,20.32 180 top
R37  68.58,62.55 270 top
R38  66.52,62.55 90 top
R39  64.45,44.93 180 top
R40  64.45,42.86 0 top
R41  68.9,39.69 270 top
R42  68.9,36.51 270 top
R43  53.02,47.31 90 top
R44  14.92,22.54 270 top
R45  33.66,5.08 180 top
R46  55.56,33.97 270 top
R47  53.02,33.5 0 top
R48  58.1,33.34 180 top
R49  69.22,30.48 90 top
R50  65.09,48.9 90 top
R51  55.56,37.15 270 top
R52  54.29,12.7 90 top
R53  57.15,11.75 180 top
R54  58.42,23.65 180 top
R55  47.31,22.54 0 top
R56  47.31,20.48 180 top
R57  47.31,18.41 180 top
R58  64.45,59.37 90 top
R59  66.52,59.37 270 top
R60  40.64,64.45 0 top
R61  39.05,80.01 180 top
R62  39.05,75.56 0 top
R63  58.1,42.86 0 top
R64  62.55,56.2 90 top
R65  67.15,48.9 90 top
R66  69.22,48.9 90 top
R67  40.64,66.67 180 top
R68  67.15,52.07 90 top
SDIO  43.5,76.52 270 top
V1  64.77,72.39 90 top
VIN  69.53,7.62 0 top
VIN_CTRL  68.9,33.66 0 top

### Tracks (layer width: path | path; a pad name or v marks a point on that pad's centre or on a via)
+3V3  (via drill 0.3)
  Top 0.305: IC15.1 v49.37,56.39 48.6,56.39 C8.1 48.45,56.53 IC15.48 | C7.1 56.95,64.75 IC15.24 56.99,63.43 v56.99,63.98
  Top 0.406: 38.4,49.23 IC4.1 38.4,49.83 38.58,50.01 | 43.48,49.23 42.76,49.95 C26.1 41.38,50.48 39.05,50.48 38.58,50.01 | IC10.7 21.17,37.66 C27.2 22.38,39.21 v22.54,39.37 | IC11.3 68.89,42.45 C9.1 69.22,42.33 v69.22,43.18 | D7.2 66.99,53.08 R68.2 | R65.2 R66.2 | R68.2 67.41,52.92 69.22,51.12 R66.2 | 3V3.TP 69.11,52.92 R68.2 | D2.2 57.78,52.7 v58.74,53.66 | D1.2 61.91,53.34 v62.23,53.66 | L2.1 51.39,53.93 v50.8,53.34 | C7.1 58.74,66.57 IC8.16 | IC5.1 43.5,48.77 v43.5,49.53 | 38.58,50.01 v38.58,50.32 | IC10.1 21.95,33.61 v22.07,33.5 | R66.2 66.57,49.74 v66.36,49.53 | D6.2 37.32,73.81 v37.15,73.98 | IC8.10 51.12,66.67 51.75,66.04 v52.7,66.04
  Top 0.813: C29.+ 61.59,30.96 v61.59,32.7
  Top 1.27: C29.+ 59.53,28.89 IC22.4 IC22.2
  Bottom 0.406: v69.22,43.18 68.58,43.18 | v50.8,53.34 51.44,52.7 | 49.53,56.52 49.49,56.52 v49.37,56.39 | v38.58,50.32 38.4,50.14 38.4,49.85 38.4,49.53 | v66.36,49.53 65.88,49.05 | v52.7,66.04 52.7,65.72 55.88,62.55
  Bottom 0.61: SDIO.1 42.55,81.6 37.15,76.2 v37.15,73.98 37.15,68.9 35.88,67.63 35.88,63.5 38.1,61.28 38.1,50.14 38.4,49.85
  Bottom 0.813: v62.23,53.66 61.28,53.66 | 61.28,53.66 v58.74,53.66 55.88,53.66 | 55.88,53.66 52.39,53.66 | 52.39,53.66 49.53,56.52 | 52.39,53.66 51.44,52.7 48.26,49.53 v43.5,49.53 38.4,49.53 28.23,39.37 v22.54,39.37 22.07,38.89 v22.07,33.5 | v61.59,31.75 v61.59,32.7 68.58,39.69 68.58,43.18 68.58,46.35 65.88,49.05 61.28,53.66 | v56.99,63.98 55.88,62.87 55.88,62.55 55.88,53.66
+5V
  Top 0.406: 67.75,25.27 L3.2 | R52.2 54.29,26.04 | R37.1 70.59,63.4 70.8,63.18 | 5V.TP 70.8,56.52
  Top 0.813: C10.2 66.24,65.47 L1.1
  Top 1.016: C51.1 51.12,26.5
  Top 1.27: L4.1 42.65,28.92 IC9.5 IC9.4 47.62,28.92 | L1.1 70.8,63.57 70.8,63.18 70.8,56.52 70.8,28.89 69.85,27.94 67.63,27.94 | 67.63,23.3 67.63,27.94 | 67.63,27.94 61.28,27.94 59.37,26.04 54.29,26.04 51.74,26.04 51.74,26.35 IC22.3 51.43,26.5 51.12,26.5 50.33,26.5 47.91,28.92 47.62,28.92 | C36.2 47.44,29.11 47.62,28.92
  Top 1.422: 67.63,23.3 L3.2
  Top 1.676: C30.2 67.89,23.31 L3.2
  Top 1.778: L3.2 68.26,22.67 C35.+
+5V/1
  Top 0.813: FRONTPANEL.1 62.46,78.51 V1.4 66.63,74.34 C11.2
+24V  (via drill 0.3)
  Top 0.406: IC10.14 14.56,33.61 v14.45,33.5 | R27.2 18.52,20.64 v13.65,20.64 | R26.2 v16.83,16.83 | IC6.1 28.73,7.46 v28.73,12.7 | IC16.4 61.28,45.4 63.82,47.94 v63.82,55.56 | v64.93,57.63 64.45,58.1 R58.1 | IC13.7 3.49,42.49 3.49,41.27 3.65,41.12 v5.08,41.12
  Top 0.61: IC7.4 v9.21,26.04 | C43.1 11.75,31.75 v11.91,31.91 | IC2.7 v50.8,41.27 | v41.59,40.64 IC1.7 | IC16.4 v61.28,39.37 | v28.73,12.7 v28.73,18.57 v28.73,19.53 | v37.47,36.2 37.41,36.25 C45.1 | v33.66,32.07 v33.66,33.02 36.83,36.2 v37.47,36.2 | v37.47,38.1 v37.47,36.2 | D4.1 28.34,65.55 K1.2
  Top 0.813: IC3.4 v11.11,37.47 | v9.37,39.21 arc45 9.42,39.35 9.42,42.86 C44.1 9.11,43.6 7.94,44.77 7.94,47.31 20.77,60.13 K1.2 | 46.94,9.73 46.94,9.89 45.4,11.43 | 45.4,11.43 43.18,11.43 v42.55,12.06 v41.59,12.06 v40.64,12.06 | 45.4,11.43 46.99,11.43 51.44,15.88 C4.1
  Top 1.016: L7.2 46.94,9.73 C42.+
  Bottom 0.406: 11.27,32.86 11.11,33.02 | v14.45,33.5 11.27,33.5 11.11,33.66 | v63.82,55.56 63.82,56.52 v64.93,57.63
  Bottom 0.61: v11.91,31.91 11.11,31.91 | v61.28,39.37 54.61,39.37 53.34,40.64 50.8,40.64 | v33.66,33.02 33.66,24.45 v28.73,19.53 v28.73,18.57 | v37.47,36.2 v37.47,38.1 40.01,40.64 v41.59,40.64 50.8,40.64 | v50.8,41.27 50.8,40.64
  Bottom 0.813: v42.55,12.06 v40.64,12.06 35.24,12.06 34.61,12.7 v28.73,12.7 24.61,12.7 23.34,13.97 18.41,13.97 R26.2 v16.83,16.83 16.83,17.46 v13.65,20.64 9.21,25.08 v9.21,26.04 11.11,27.94 11.11,31.91 11.11,33.02 11.11,33.66 v11.11,37.47 v9.37,39.21 8.89,39.69 6.99,39.69 5.56,41.12 v5.08,41.12
-8V  (via drill 0.3)
  Top 0.305: v9.21,37.47 11.11,35.56 13.97,35.56 14.62,36.21 IC10.10
  Top 0.406: R51.2 56.41,36.3 v56.52,36.2 | -8V.TP 44.39,36.83 IC1.4 | IC13.4 4.79,39.23 v5.08,39.53
  Top 0.61: C43.2 9.21,31.75 v8.26,32.7 | IC2.4 v53.34,39.37 | v44.13,38.73 IC1.4 | IC16.11 v61.28,36.83 | C45.2 39.11,36.25 v39.05,36.2 | v39.53,37.94 39.05,37.47 v39.05,36.2 | v34.61,32.38 37.15,34.92 37.78,34.92 v39.05,36.2
  Top 0.813: IC7.11 v6.67,26.04 | IC3.11 v9.21,37.47 10.82,39.08 arc45 10.9,39.26 C24.1 | C13.- v35.56,15.24 v35.56,14.29 v35.56,13.34 | v22.54,16.19 22.54,12.86 v21.91,12.86 v22.86,12.86
  Top 1.27: C14.1 L8.2 39.42,15.9 C13.-
  Bottom 0.406: 56.52,36.83 v56.52,36.2
  Bottom 0.61: v8.26,32.7 9.21,32.7 | v61.28,36.83 56.52,36.83 55.88,36.83 53.98,38.73 53.34,38.73 | v39.05,36.2 39.05,37.47 40.32,38.73 v44.13,38.73 53.34,38.73 | v35.56,15.24 34.61,16.19 v34.61,32.38 v35.24,33.02 | v53.34,39.37 53.34,38.73
  Bottom 0.813: 7.94,26.67 7.38,26.11 arc-45 7.2,26.04 v6.67,26.04 | v35.56,13.34 35.56,13.97 | v35.56,15.24 v35.56,14.29 35.56,13.97 | 7.94,26.67 9.21,27.94 9.21,32.7 v9.21,37.47 8.26,38.42 6.19,38.42 v5.08,39.53 | 7.94,26.67 7.94,24.45 15.56,16.83 15.56,15.24 17.94,12.86 v22.86,12.86 v21.91,12.86 | 35.56,13.97 25.08,13.97 23.65,15.4 v22.54,15.4 v22.54,16.19
ADC_5V
  Top 0.305: IC15.18 60.08,60.39 61.59,61.91 64.24,61.91 C15.1
  Top 0.406: R37.2 R38.1 C15.1
ADC_-8V
  Top 0.305: IC15.16 61.68,59.39 C23.1
  Top 0.406: R64.2 C23.1
ADC_BATTERY  (via drill 0.3)
  Top 0.305: IC15.11 54.95,59.34 v50.8,63.5 | v38.42,66.67 38.42,70.97 D6.3
  Top 0.406: R61.2 C48.1 R62.1 39.05,74.72 D6.3
  Bottom 0.305: v50.8,63.5 41.59,63.5 v38.42,66.67
ADC_BIAS_CURRENT
  Top 0.305: 64.45,56.2 61.59,56.2 61.59,57.78 60.49,58.89 IC15.15
  Top 0.406: R68.1 C22.1 | R50.2 C22.1 | C22.1 66.04,51.22 D7.3 65.58,56.2 64.45,56.2
ADC_HIGH_CURRENT
  Top 0.305: IC15.14 60.03,58.39 60.96,57.47 D1.3
  Top 0.406: D1.3 60.96,51.12 | 60.96,51.12 60.96,50.27 C2.1 | R24.1 61.06,51.02 60.96,51.12
ADC_LOW_CURRENT
  Top 0.305: IC15.13 56.83,57.77 D2.3
  Top 0.406: D2.3 56.83,51.12 | 56.83,51.12 56.83,50.27 C3.1 | R25.1 56.94,51.02 56.83,51.12
ADC_PUSHPULL_OUT  (via drill 0.3)
  Top 0.305: IC15.12 55.45,59.8 v51.75,63.5 | v46.67,64.14 41.81,64.14 R60.2
  Top 0.406: R60.2 R67.1 C47.1
  Bottom 0.305: v51.75,63.5 51.12,64.14 v46.67,64.14
ADC_TEMP  (via drill 0.3)
  Top 0.305: IC15.10 54.45,47.15 53.76,46.46 R43.1
  Top 0.406: IC6.3 36.51,2.22 35.56,2.22 32.8,4.98 R45.2 29.53,8.36 v29.53,24.13 | R43.1 C21.1 46.77,46.46 45.09,44.77 v45.09,41.59 45.09,41.91 | v29.53,26.67 32.07,29.21 32.07,33.66 35.56,37.15 35.56,38.73 v37.47,40.64
  Bottom 0.406: v29.53,24.13 v29.53,26.67 | v37.47,40.64 38.42,41.59 v45.09,41.59
ADC_VIN
  Top 0.305: R58.2 64.24,60.22 63.18,61.28 61.91,61.28 60.53,59.89 IC15.17
  Top 0.406: C46.1 R59.1 R58.2
BATTERY+
  Top 0.406: R61.1 38.95,80.96 32.1,80.96 BAT_OUT.1
  Top 1.93: BAT_OUT.4 24.36,79.97 26.9,77.43 | 29.44,74.89 31.98,72.35 | BAT_OUT.2 29.44,74.89 | BAT_OUT.1 31.98,72.35 | BAT_OUT.3 26.9,77.43 | 26.9,77.43 29.44,74.89 | K1.S 32,72.33 31.98,72.35
BIAS_CTRL
  Top 0.406: R28.2 19.61,26.65 22.2,26.65 39.69,44.13 42.86,44.13 45.42,46.7 IC5.4
BIAS_CURRENT  (via drill 0.3)
  Top 0.406: Q7.B 16.02,19.68 Q7.C 17.63,18.73 Q9.C 21.91,17.46 24.45,20 26.35,20 v26.99,19.37 | Q6.B 38.1,9.21 34.61,12.7 v34.61,14.92
  Bottom 0.406: v34.61,14.92 31.27,14.92 26.99,19.21 v26.99,19.37
CS_DAC1
  Top 0.305: IC15.3 50.95,55.08 48.72,52.85 IC5.5
CS_DAC2  (via drill 0.3)
  Top 0.305: IC15.2 50.45,55.53 50.16,55.24 46.67,55.24 v45.56,54.13
  Top 0.406: v40.96,53.66 40.34,53.05 IC4.5
  Bottom 0.305: v45.56,54.13 44.13,52.7 41.27,52.7 40.96,53.02 v40.96,53.66
CS_POT  (via drill 0.3)
  Top 0.305: IC10.3 24.91,34.91 36.35,46.51 37.15,47.31 37.15,53.98 37.78,54.61 39.69,54.61 40.32,55.24 42.86,55.24 v43.18,55.56 | v45.09,57.47 46.51,58.89 IC15.46
  Bottom 0.305: v43.18,55.56 v45.09,57.47
CURRENT_CTRL_SINK
  Top 0.406: R34.2 24.77,31.75 40.34,47.33 IC4.4
CURRENT_CTRL_SOURCE  (via drill 0.3)
  Top 0.406: IC3.12 9.53,36.2 10.16,35.56 10.16,33.66 11.11,32.7 v16.19,32.7 | v18.41,32.7 24.45,32.7 39.69,47.94 39.69,48.74 IC4.3
  Bottom 0.406: v16.19,32.7 v18.41,32.7
CURRENT_SENSE  (via drill 0.3)
  Top 0.305: 42.86,39.69 43.34,40.16 44.61,40.16 45.09,39.69 46.51,39.69 47.36,40.54 R15.2
  Top 0.406: C20.2 1.48,26.89 1.37,26.99 | 1.37,26.99 R36.2 1.37,18.95 3.49,16.83 11.75,16.83 v12.06,17.14 | 1.37,26.99 R35.2 C19.2 R11.1 1.37,42.49 2.54,43.66 3.81,43.66 4.13,43.33 IC13.6 | 42.86,39.69 39.43,39.69 R19.2 36.2,38.16 36.2,36.83 32.7,33.34 32.7,28.57 27.94,23.81 v27.94,11.75
  Bottom 0.406: v27.94,11.75 17.78,11.75 12.38,17.14 v12.06,17.14
EXT_MISO
  Top 0.305: IC15.27 54.45,66.19 53.66,66.99 IC8.12
EXT_MOSI  (via drill 0.3)
  Top 0.305: IC15.28 53.95,65.74 v53.66,66.04 | v55.72,66.04 56.2,66.52 IC8.14
  Bottom 0.305: v53.66,66.04 v55.72,66.04
EXT_SCK
  Top 0.305: IC15.26 54.95,67.76 IC8.13
GND  (via drill 0.3)
  Top 0.305: IC7.10 v6.67,27.3 | v14.92,24.13 14.76,23.97 12.06,23.97 11.91,24.13 9.21,24.13 8.73,23.65 v8.73,22.07 | IC15.8 53.45,55.52 52.39,54.45 52.39,53.02 51.54,52.17 C6.2 | IC15.23 58.34,62.89 v58.63,63.18 C7.2 | IC15.44 49.33,59.89 49.85,59.37 v49.85,58.74 49.5,58.39 IC15.47 47.6,58.39 46.77,57.57 C8.2
  Top 0.406: Q3.E 7.62,4.13 8.57,5.08 R6.2 | IC3.3 13.65,36.2 14.24,36.79 arc-45 14.42,36.86 IC10.9 14.36,36.86 arc45 v14.29,36.83 | R32.2 v14.92,30.96 | R44.1 v14.92,24.13 | 38.4,52.37 IC4.8 38.4,51.77 39.05,51.12 41.38,51.12 C26.2 42.76,51.65 43.48,52.37 IC5.8 43.5,52.83 v43.5,51.44 | 56.94,15.66 IC12.EXP | IC12.7 58.42,12.17 R53.1 | R54.1 C32.2 | Q11.E Q12.E 19.69,10.16 20,10.48 20,15.24 v20.16,15.4 | IC10.6 20.29,36.86 19.47,37.68 C27.1 | C9.2 67.94,42.76 IC11.2 67.94,45.09 67.63,45.4 v67.31,45.4 | R38.2 C15.2 63.05,64.8 C10.1 | R59.2 C46.2 69.33,58.52 v69.48,58.37 | D1.1 C2.2 59.16,51.02 v59.05,51.12 | D2.1 C3.2 55.35,51.02 v55.24,51.12 | R43.2 C21.2 51.06,48.26 51.44,48.26 51.54,48.36 C12.2 | C6.2 C12.2 | R67.2 C47.2 39.79,69 v40.64,69.85 | C48.2 R62.2 | D6.1 39.9,73.91 R62.2 | R49.1 66.73,29.63 C29.- | R21.2 39.05,34.92 v38.89,34.77 | R17.2 54.29,35.98 v54.29,36.51 | C16.2 66.83,35.08 v66.52,34.77 | IC16.5 60.01,42.23 v60.33,42.55 | IC16.3 62.55,39.37 v62.87,39.05 | D7.1 C22.2 v65.09,55.24 | C23.2 62.76,60.01 v63.18,60.01 | v50.48,49.85 C12.2 | R62.2 v40.64,75.56 | Q13.E 39.69,62.23 v39.37,62.55 | IC16.12 v62.55,36.83 | IC3.5 v14.29,38.73 | R10.2 5.5,35.03 v5.87,35.4
  Top 0.61: IC12.3 57.15,17.14 IC12.EXP 58.42,15.88 IC12.7 | C38.2 46.04,25.03 IC9.2 | v19.68,40.01 19.47,39.79 C27.1
  Top 0.813: C44.2 v6.67,43.18 | C24.2 v13.34,43.18 | 57.47,69.85 63.5,69.85 V1.1 63.05,66.86 C10.1 | 57.47,69.85 50.16,69.85 49.85,69.53 IC8.9 49.85,67.63 v48.9,67.63 | IC8.15 57.47,69.85
  Top 1.016: C38.2 R55.1 46.14,22.23 44.45,22.23 | C42.- 50.64,10 v50.48,9.84 | 51.12,21.59 v51.44,21.59 | C4.2 51.12,19.18 51.12,21.59 | 51.12,21.59 C51.2
  Top 1.27: C34.1 62.68,14.18 D10.A 62.52,14.31 | 60.33,16.51 IC12.EXP | C36.1 39.59,30.8 D8.C | C1.1 C14.2 44.26,15.85 C13.+ | C29.- v63.82,30.16 | IC22.1 52.93,31.2 v53.02,31.11
  Top 1.676: C28.1 18.71,44.32 17.44,45.59
  Top 1.778: 17.65,45.27 17.44,45.59 R7.2
  Bottom 0.305: v6.67,27.3 5.87,26.51 5.87,24.92 v8.73,22.07
  Bottom 0.406: v20.16,15.4 20.16,24.29 20.32,24.45 20.32,24.77 19.68,25.4 14.92,25.4 | v38.89,34.77 38.26,34.77 38.1,34.61 | v54.29,36.51 54.29,34.61 | v62.87,39.05 64.45,39.05 | v67.31,45.4 66.67,45.4 | v39.37,62.55 37.15,64.77 37.15,67.31 39.69,69.85 v40.64,69.85 | v51.12,20.32 51.12,19.18 C4.2 | v62.55,36.83 63.02,36.35 | v5.87,35.4 5.87,34.13 8.26,31.75 8.26,28.89 v6.67,27.3
  Bottom 0.61: v13.34,43.18 14.21,42.3 arc-45 14.29,42.12 v14.29,38.73 v14.29,36.83 16.09,36.83 arc-45 16.27,36.76 17.14,35.88 | 17.14,35.88 17.14,35.03 arc-45 17.07,34.85 15,32.78 arc45 14.92,32.6 v14.92,30.96 14.92,25.4 v14.92,24.13 | 17.14,35.88 17.14,37.47 v19.68,40.01 | v65.09,55.24 64.45,54.61 63.18,54.61 60.64,57.15 | 60.64,57.15 58.63,59.16 v58.63,63.18 58.63,64.14 60.97,66.47 61.38,66.47 | v63.18,60.01 60.64,57.47 60.64,57.15 | 53.66,52.07 52.7,52.07 v50.48,49.85
  Bottom 0.813: 4.76,42.55 5.32,43.11 arc-45 5.5,43.18 v6.67,43.18 v13.34,43.18 | 49.69,67.63 49.21,67.63 53.02,63.82 53.02,61.91 v49.85,58.74 47.94,56.83 47.94,53.98 45.4,51.44 v43.5,51.44
  Bottom 1.016: v50.48,9.84 50.16,9.84 51.75,8.57
  Bottom 1.27: v63.82,30.16 52.07,30.16 | 51.44,34.61 53.02,33.02 v53.02,31.11 | 51.44,34.61 38.1,34.61 36.51,34.61 35.24,35.88 30.8,35.88 21.27,26.35 19.05,26.35 17.46,24.77 15.56,24.77 v14.92,24.13 | 51.44,34.61 54.29,34.61 61.28,34.61 | 61.28,34.61 63.02,36.35 64.45,37.78 64.45,39.05 64.45,42.55 | 64.45,42.55 66.67,44.77 66.67,45.4 66.67,46.35 61.91,51.12 v59.05,51.12 v55.24,51.12 54.61,51.12 53.66,52.07 | 64.45,42.55 v60.33,42.55 46.99,42.55 45.09,44.45 40.64,44.45 39.05,46.04 | 61.28,34.61 60.01,33.34 60.01,29.21 62.87,29.21 65.09,31.43 65.09,33.34 v66.52,34.77 70.8,39.05 70.8,57.05 v69.48,58.37 61.38,66.47 58.95,68.9 50.8,68.9 49.53,67.63 49.21,67.63 v48.9,67.63 42.86,67.63 v40.64,69.85 v40.64,75.56 40.64,76.2 40.96,76.52 SDIO.3
  Bottom 1.422: Q3.E 7.62,8.57 11.59,12.54 11.91,12.54 | 51.75,8.57 15.88,8.57 2.22,22.23 2.22,44.45 R9.2
  Bottom 1.93: v53.02,31.11 52.07,30.16 51.44,29.53 v51.44,21.59 C4.2 51.44,8.89 51.75,8.57 | v56.83,15.56 53.98,12.7 53.98,11.43 52.07,9.53 50.8,9.53 v50.48,9.84 50.8,10.48 v47.62,13.65
  Bottom 3.302: GND.1 68.58,2.86 63.18,8.26 52.07,8.26 51.75,8.57 | Q1.C 24.77,2.86 26.99,5.08 26.99,8.57
  Bottom 3.81: R9.2 R8.2 R7.2 | 51.75,8.57 50.8,9.53 51.12,9.53
  other vias: 57.78,16.51 58.74,16.51 58.74,17.46 57.78,17.46 56.83,17.46 56.83,16.51 57.78,15.56 58.74,15.56 49.53,15.24 49.53,16.51 49.53,17.78 49.53,19.05 49.53,20.32 49.53,21.59 49.53,22.86 49.53,25.4 48.9,30.16 48.9,31.43 46.99,32.38 46.04,32.38 44.77,32.38 43.5,32.38 42.23,32.38 40.96,32.38 39.69,32.38 38.42,32.38 37.47,31.75 36.51,30.8 35.88,29.84 35.88,28.57 35.88,27.3 35.88,26.04 35.88,24.77 35.88,23.5 35.88,22.23 35.88,20.95 35.88,19.68 35.88,18.41 35.88,17.14 36.51,13.34 37.78,13.34 39.05,13.34 40.32,13.34 41.59,13.34 42.86,13.34 44.13,13.34 45.4,13.34 46.67,13.34 44.77,18.41 43.81,18.41 45.4,22.23 46.35,23.34 46.04,27.62 45.09,27.62 46.99,27.62 43.18,30.16 43.18,31.43 41.27,31.43 41.27,30.16 37.47,30.48 66.36,26.67 65.09,26.67 63.82,26.67 62.55,26.67 61.59,26.35 60.64,25.4 59.69,24.77 58.42,24.77 57.15,24.77 55.88,24.77 55.24,24.13 53.34,22.23 53.34,20.95 53.34,19.68 53.34,18.41 53.34,17.14 53.34,15.88 53.34,14.61 54.29,10.64 55.4,10.64 57.15,10.64 58.1,10.64 61.28,10.64 62.71,10.64 64.14,10.64 66.67,11.11 66.67,12.38 66.67,13.65 69.85,13.65 69.85,12.38 69.85,11.11 64.14,14.29 60.96,14.29 62.55,16.19 70.17,19.05 71.12,19.05 70.17,21.91 71.12,21.91 68.9,26.67 69.85,25.72 70.8,24.77 60.33,23.5 60.33,21.59 53.18,12.7
  pour Top (isolate 0.305): 71.75,10.48 71.75,24.45 68.58,27.62 62.23,27.62 60.64,26.04 56.83,26.04 53.02,22.23 53.02,11.43 53.98,10.48
  pour Bottom (isolate 0.305): 71.75,10.48 71.75,24.45 68.58,27.62 62.23,27.62 60.64,26.04 56.83,26.04 53.02,22.23 53.02,11.43 53.98,10.48
  pour Top (isolate 0.305): 49.85,13.65 49.85,27.62 49.21,28.26 49.21,32.07 48.58,32.7 38.1,32.7 35.56,30.16 35.56,13.65 36.2,13.02 49.21,13.02
  pour Bottom (isolate 0.305): 49.85,13.65 49.85,27.62 49.21,28.26 49.21,32.07 48.58,32.7 38.1,32.7 35.56,30.16 35.56,13.65 36.2,13.02 49.21,13.02
  pour Bottom (isolate 0.406): -0.32,85.41 -0.32,48.9 18.41,48.9 20,47.31 20,44.77 18.73,43.5 5.4,43.5 4.76,42.86 4.76,41.27 3.49,40.01 3.49,38.1 6.67,34.92 6.67,24.13 19.68,11.11 32.7,11.11 34.61,13.02 34.61,30.48 37.78,33.66 48.9,33.66 50.16,32.38 50.16,28.26 50.8,27.62 50.8,23.81 52.07,22.54 56.52,26.99 60.33,26.99 61.91,28.57 72.71,28.57 72.71,67.66 71.05,69.16 68.4,71.8 48.26,71.75 46.67,73.34 46.4,81.9 43.37,84.93 42.87,85.41
  pour Bottom (isolate 0.305, no thermals): 65.09,4.45 63.18,4.45 61.59,6.03 50.16,6.03 49.53,6.67 45.4,6.67 44.77,6.03 41.91,6.03 40.32,4.45 31.75,4.45 30.8,5.4 25.72,5.4 24.45,6.67 12.38,6.67 10.16,4.45 4.76,4.45 0.64,8.57 0.64,47.31 0.95,47.62 4.45,47.62 5.4,46.67 5.4,44.77 3.81,43.18 3.81,39.37 5.08,38.1 5.08,24.45 11.11,18.41 11.11,16.83 17.14,10.79 49.85,10.79 51.75,8.89 60.64,8.89
GND1
  Top 0.406: IC8.8 49.85,80.75 FRONTPANEL.6
  Top 0.813: V1.3 57.47,73.66 | 57.47,73.66 51.75,73.66 49.85,75.56 IC8.8 | IC8.2 57.47,73.66
INT_MISO  (via drill 0.3)
  Top 0.305: IC10.5 24.14,36.21 35.88,47.94 35.88,54.61 40.64,59.37 v43.18,59.37 | v44.45,60.33 46.02,61.89 IC15.40
  Bottom 0.305: v43.18,59.37 44.13,60.33 v44.45,60.33
INT_MOSI  (via drill 0.3)
  Top 0.305: IC15.41 46.47,61.39 44.45,59.37 v44.45,55.56 | v42.55,53.34 42.23,53.66 | IC10.4 24.45,35.56 36.51,47.62 36.51,54.29 37.47,55.24 v39.37,55.24
  Top 0.406: IC4.7 39.05,52.08 39.37,51.75 40.64,51.75 40.96,52.07 40.96,52.39 42.23,53.66 42.55,53.98 43.81,53.98 44.13,53.66 44.13,52.86 IC5.7
  Bottom 0.305: v44.45,55.56 42.55,53.66 v42.55,53.34 40.64,55.24 v39.37,55.24
INT_SCK
  Top 0.305: IC15.39 45.56,62.39 43.81,60.64 43.81,54.61 | IC10.2 25.05,34.26 37.78,46.99 37.78,53.66 38.1,53.98 40.01,53.98
  Top 0.406: IC5.6 44.77,53.97 44.13,54.61 43.81,54.61 40.64,54.61 40.01,53.98 39.69,53.66 39.69,52.86 IC4.6
LM2611_SW
  Top 0.406: IC9.1 44.99,26.42 44.06,26.42
  Top 1.27: C37.2 44.26,26.22 44.06,26.42 L4.2
N$1
  Top 0.406: IC7.3 12.6,24.77 R23.1 14.39,24.87 17.14,27.62 R13.1 R22.1
N$2  (via drill 0.3)
  Top 0.406: v46.04,5.08 45.72,5.4 45.72,6.67 45.19,7.2 R1.2
  Bottom 0.406: Q2.B 51.12,2.86 48.58,5.4 46.35,5.4 v46.04,5.08
  Bottom 0.813: Q4.C 61.91,3.49 60.96,4.45 54.67,4.45 Q2.B
N$3  (via drill 0.3)
  Top 0.406: Q4.B 61.91,4.76 R2.1 | Q6.C 43.01,5.57 v43.34,5.24
  Bottom 0.406: Q4.B 61.28,5.4 49.85,5.4 49.21,6.03 45.72,6.03 44.93,5.24 v43.34,5.24
N$4
  Top 0.406: IC7.6 12.48,28.57 R30.2 R32.1
N$5
  Top 0.406: IC3.10 6.35,38.73 5.87,39.21 5.87,40.32 | 5.87,40.32 5.87,44.29 6.67,45.09 6.67,47.94 10.48,51.75 10.48,75.88 9.84,76.52 | IC13.3 4.13,40.01 4.45,40.32 5.87,40.32
  Top 1.676: BAT_OUT.8 14.2,76.61 14.29,76.52 | BAT_OUT.7 16.74,76.75 16.51,76.52
  Top 1.93: BAT_OUT.6 19.28,78.65 R7.1 17.5,76.52 BAT_OUT.5
  Top 3.81: R9.1 9.84,76.52 R8.1 14.29,76.52 16.51,76.52 R7.1
N$6
  Top 0.406: IC16.9 58.74,33.55 R48.1 58,32.38 56.52,32.38 55.78,33.12 R46.2
N$7  (via drill 0.3)
  Top 0.305: R5.1 26.35,5.71
  Top 0.813: v24.13,5.71 26.35,5.71 27.05,5.71 Q1.B
  Bottom 0.813: v24.13,5.71 13.02,5.71 10.16,2.86 Q3.C
N$8
  Top 0.813: L1.2 C11.1 65.45,70.44 V1.2
N$9
  Top 0.406: Q5.C 12.7,5.54 12.7,5.08 | 12.7,5.08 Q3.B | R6.1 12.7,5.08
N$10
  Top 0.406: Q8.E 14.75,17.76 Q7.E
N$11
  Top 0.305: R23.2 12.6,26.67 9.21,26.67 8.89,26.99 8.89,29.53 9.21,29.84 IC7.7
  Top 0.406: IC7.7 12.48,29.84 R30.1
N$12
  Top 0.406: Q14.E 10.02,20.64 D3.1
N$13
  Top 0.61: K1.1 37.13,60.13 Q13.C 38.1,61.45 D4.2
N$14
  Top 0.406: R10.1 3.29,36.73 R11.2 3.48,36.92 IC13.2
N$15
  Top 0.406: IC3.6 IC3.7
N$16
  Top 0.406: IC2.3 52.07,35.66 R17.1 R14.1
N$17
  Top 0.305: R15.1 48.68,38.84 49.31,39.47 50.8,39.47
  Top 0.406: IC2.2 50.8,39.47 52.17,39.47 53.02,40.32 54.08,40.32 R16.2
N$18
  Top 0.406: IC2.6 52.07,41.59 52.49,41.17 R16.1 54.93,42.17 R24.2
N$20
  Top 0.406: IC1.3 42.86,35.03 R18.1 R21.1
N$21
  Top 0.406: R19.1 41.59,38.84 | IC1.2 41.59,38.84 | R20.2 45.14,38.84 44.45,39.53 43.81,39.53 43.12,38.84 41.59,38.84
N$22
  Top 0.406: IC1.6 42.86,40.96 43.02,40.8 45.62,40.8 R20.1 45.88,43.34 47.94,45.4 54.93,45.4 57.94,48.42 R25.2
N$23
  Top 0.305: IC10.12 12.78,34.91 IC3.2
N$24
  Top 0.406: Q11.C Q10.C 21.1,15.24 | 21.1,15.24 Q9.B 19.37,16.51 18.9,16.05 Q10.B | 21.1,15.24
N$25  (via drill 0.3)
  Top 0.406: Q12.B 15.88,12.06 | 15.88,12.06 16.83,12.06 | 16.83,12.06 Q11.B | Q12.C 16.98,11.91 16.83,12.06 | R28.1 v19.37,24.45 | v17.94,16.35 17.78,16.51 17.78,17.14 17.3,17.62 16.35,17.62 15.88,17.14 15.88,12.06
  Bottom 0.406: v19.37,24.45 19.37,17.78 v17.94,16.35
N$26
  Top 0.406: Q13.B 42.13,60.33 R31.2
N$27
  Top 0.406: IC16.13 IC16.14
N$28
  Top 0.406: Q10.E 17.56,13.34 R26.1
N$29
  Top 0.406: Q9.E 21.1,19.75 R27.1
N$30
  Top 0.406: 55.82,19.05 IC12.4 C33.1 56.41,21.59 C32.1
N$31
  Top 0.406: Q14.B 11.75,18.73 12.06,19.05 12.06,20 12.7,20.64 C5.2 11.85,22.23 IC7.1
N$35
  Top 0.406: R39.1 66.17,44.93 IC11.1
N$36  (via drill 0.3)
  Top 0.406: R33.2 3.39,28.57 IC7.9 v6.67,28.57 | v7.46,31.43 8.1,30.8 11.75,30.8 12.06,31.11 13.97,31.11 14.61,31.75 v16.19,31.75 | v18.41,31.75 R34.1
  Bottom 0.406: v16.19,31.75 v18.41,31.75 | v6.67,28.57 7.46,29.37 v7.46,31.43
N$37
  Top 0.406: R33.1 3.39,29.84 IC7.8 6.99,29.84 7.62,29.21 7.62,25.4 6.99,24.77 IC7.12
N$38
  Top 0.406: D5.1 8.57,17.78 8.26,18.1 8.26,20.64 6.99,21.91 6.99,23.81 8.26,25.08 8.26,29.53 6.25,31.54 C18.2 6.25,32.34 IC3.14
N$39
  Top 0.406: C19.1 R35.1 C18.1 4.55,32.8 6.67,34.92 IC3.13
N$40
  Top 0.406: C17.2 3.39,22.23 IC7.14 5.34,21.5 Q14.C
N$41
  Top 0.406: IC16.2 63.82,42.65 R40.1 R39.2
N$42
  Top 0.406: IC7.13 3.39,23.5 C17.1 | C17.1 C20.1 | R36.1 2.22,21.17 2.22,22.76 C17.1
N$43
  Top 0.406: R40.2 65.09,42.65 IC16.1 68.73,40.7 R41.1
N$44
  Top 0.406: R41.2 R42.1 C16.1
N$45  (via drill 0.3)
  Top 0.406: IC8.1 v58.74,78.74 58.74,79.38 58.74,79.66 FRONTPANEL.2 | IC8.7 v51.12,78.74
  Bottom 0.406: v51.12,78.74 v58.74,78.74
N$46
  Top 0.406: IC8.3 56.2,79.66 FRONTPANEL.3
N$47
  Top 0.406: IC8.4 54.93,80.75 FRONTPANEL.4
N$48
  Top 0.406: IC8.5 53.66,79.48 FRONTPANEL.5
N$49
  Top 0.406: R54.2 56.78,23.65 C33.2
N$50
  Top 0.406: R47.2 53.87,33.12 55.24,31.75 59.05,31.75 60.01,32.7 60.01,33.66 | 60.01,33.66 IC16.10 | R49.2 66.89,33.66 60.01,33.66
N$51
  Top 0.406: IC6.2 34.51,4.87 R45.1
N$52
  Top 0.406: 60.33,19.05 60.27,19.11 IC12.1
  Top 0.61: IC12.1 60.01,19.43 60.01,19.68
  Top 1.676: D10.C 61.28,18.71 60.98,18.71
  Top 1.778: 60.98,18.71 60.64,19.05 60.33,19.05 | L3.1 63.05,20.49 61.28,18.71
N$53  (via drill 0.3)
  Top 0.406: C39.1 R57.2 46.46,18 v45.72,18.73 | v42.55,22.23 C1.2
  Top 1.27: C1.2 41.39,22.3 L5.2 37.42,20.98 L8.1
  Bottom 0.406: v45.72,18.73 42.55,21.91 v42.55,22.23
N$54
  Top 0.406: IC12.5 55.88,12.06 55.98,12.06 R53.2 56.2,11.85 R52.1
N$55
  Top 0.305: 61.91,38.73 61.91,42.55 62.23,42.86
  Top 0.406: R48.2 57.47,33.55 IC16.8 57.47,37.15 58.1,37.78 60.96,37.78 61.91,38.73 | 62.23,42.86 62.23,45.19 R50.1
N$56
  Top 1.27: C37.1 41.22,24.7 39.37,24.7 | 39.37,24.7 L5.1 | D8.A 39.37,24.7
N$57
  Top 0.254: 47.31,25.4 47.31,21.27
  Top 0.406: IC9.3 46.99,25.72 47.31,25.4 | 47.31,21.27 46.46,20.42 R56.2 46.46,20.38 48.16,18.68 R57.1 C39.2
N$58
  Top 0.406: R56.1 R55.2 C38.1
N$59
  Top 0.406: R63.2 58.74,42.65 IC16.6 58.74,39.37 57.37,38 R51.1
N$60
  Top 0.406: IC16.7 57.47,42.65 R63.1 58.2,43.81 58.74,43.81 63.18,48.26 63.18,54.71 R64.1
NRST
  Top 0.305: IC15.7 52.95,60.39 46.35,66.99 46.35,69.53 44.45,71.44 SDIO.5
OUTPUT_ENABLE
  Top 0.305: IC15.38 42.99,62.89 R31.1
PUSHPULL_CTRL
  Top 0.406: D3.2 D5.2 13.16,15.24 | 13.16,15.24 13.16,14.29 | 13.16,14.29 13.16,8.74 14.61,7.3 14.61,6.5 Q5.B | Q8.C 13.16,15.24 | Q8.B 13.17,14.29 13.16,14.29
PUSHPULL_OUT  (via drill 0.3)
  Top 0.406: R29.2 17.78,23.39 | 17.78,23.39 R12.2 | v17.78,26.99 17.78,23.39 | R4.2 25.4,46.86 18.41,39.88 18.41,37.78 19.68,36.51 v19.68,33.66 | R60.1 35.24,64.45 K1.P
  Top 1.676: C28.2 21.14,47.94 R4.2
  Top 3.81: R4.2 28.89,47.94 | 28.89,47.94 R3.1 | K1.P 28.89,47.94
  Bottom 0.406: v19.68,33.66 19.68,31.43 17.78,29.53 v17.78,26.99
RI_COMP
  Top 0.305: IC3.1 12.79,33.62 13.65,33.62 14.29,34.26 IC10.13 15.9,34.26 17.14,33.02 R13.2
  Top 0.406: 12.06,33.66 IC3.1
SCL  (via drill 0.3)
  Top 0.305: v60.01,61.59 59.71,61.89 IC15.21
  Top 0.406: IC11.5 67.94,47.25 R65.1 67.68,48.58 v67.94,48.58
  Bottom 0.406: v67.94,48.58 68.9,49.53 68.9,55.88 63.18,61.59 v60.01,61.59
SDA  (via drill 0.3)
  Top 0.305: v60.64,62.55 60.49,62.39 IC15.22
  Top 0.406: IC11.4 68.89,47.73 R66.1 69.22,47.31 v69.53,46.99
  Bottom 0.406: v69.53,46.99 69.53,56.2 63.18,62.55 v60.64,62.55
SENSE_COMP  (via drill 0.3)
  Top 0.305: R22.2 18.84,30.06 17.78,31.11 17.78,33.34 16.19,34.92 16.19,35.24 15.88,35.56 IC10.11 v16.19,35.56
  Top 0.406: IC3.9 v7.56,40.64 IC3.8
  Bottom 0.406: v16.19,35.56 12.49,35.56 arc-45 12.31,35.63 12.06,35.88 12.06,37.68 arc45 11.99,37.86 9.21,40.64 v7.56,40.64
SWCLK
  Top 0.305: IC15.37 45.72,66.13 45.72,69.22 44.77,70.17 42.23,70.17 41.59,70.8 41.59,77.15 SDIO.2
SWDIO
  Top 0.305: IC15.34 50.95,65.89 50.8,66.04 48.9,66.04 46.99,67.94 46.99,71.44 44.45,73.98 SDIO.4
VIN
  Top 0.406: R2.2 64.45,7.62
  Top 0.813: C34.2 59.69,11.94 IC12.8
  Top 1.016: L7.1 51.28,6.83
  Top 1.422: Q4.E 59.37,7.3 59.05,7.62
  Top 1.676: C34.2 59.88,7.81 59.69,7.62
  Top 3.81: Q2.C 47.62,3.17 51.28,6.83 52.07,7.62 59.05,7.62 59.69,7.62 64.45,7.62 VIN.1
VIN_CTRL
  Top 0.406: VIN_CTRL.1 R42.2
VOLTAGE_CTRL
  Top 0.305: IC7.5 10.7,27.46 15.56,27.46 16.03,27.94 16.03,28.73 16.51,29.21 20.32,29.21
  Top 0.406: IC5.3 44.77,47.31 42.55,45.09 39.37,45.09 23.5,29.21 20.32,29.21
VOLTAGE_FEEDBACK
  Top 0.406: 12.81,23.28 C5.1 | R12.1 R29.1 R44.2 14.66,21.69 13.28,23.07 C5.1 | IC7.2 11.75,23.5 12.17,23.07 C5.1
VOUT_HIGHSIDE
  Top 0.406: 42.08,2.94 Q2.E | Q6.E 40.64,7.3 38.86,5.52 | 42.16,4.6 Q2.E | R1.1 42.16,2.9 Q2.E | R3.2 34.61,20 34.61,30.16 37.78,33.34 52.07,33.34 52.07,33.39 R47.1
  Top 3.81: R3.2 32.07,11.68 38.23,5.52 38.86,5.52 41.53,2.86 Q2.E
VOUT_LOWSIDE  (via drill 0.3)
  Top 0.305: R5.2 26.35,8.57 24.77,10.16
  Top 0.406: Q5.E 16.07,7.3 18.99,4.38 | R46.1 55.35,34.61 51.44,34.61 50.8,33.97 37.47,33.97 33.97,30.48 33.97,27.62 v32.7,26.35
  Top 3.81: R4.1 25.4,10.79 24.77,10.16 18.99,4.38 Q1.E
  Bottom 0.406: v32.7,26.35 25.4,19.05 R4.1
VREF  (via drill 0.3)
  Top 0.305: IC15.9 53.95,54.54 L2.2 | 46.99,37.78 46.99,39.37 47.31,39.69 48.58,39.69 48.9,40.01 48.9,41.27 48.58,41.59 v48.58,44.45
  Top 0.406: IC4.2 39.05,49.52 39.37,49.85 40.64,49.85 40.96,49.53 40.96,49.21 42.55,47.62 v43.81,47.62 44.13,47.94 44.12,47.95 IC5.2 | C12.1 53.24,50.8 | 53.24,50.8 C6.1 53.24,53.83 L2.2 | 46.99,34.92 48.36,34.92 R14.2 | R18.2 46.99,34.92 | 46.99,34.92 46.99,37.78 | IC11.6 64.8,46.7 v64.45,46.35 | v52.7,50.8 53.24,50.8
  Bottom 0.406: v64.45,46.35 57.15,46.35 v52.7,50.8 49.53,47.62 48.58,47.62 | 48.58,47.62 v43.81,47.62 | v48.58,44.45 48.58,47.62

### Text on the board
tPlace: MISO | MOSI | 5V | OUT- | OUT+ | GND | SCK | 3V3 | 3V3 | SWCLK | GND | SWDIO | NRST
bPlace: github.com/jankae/battery-sim | batsim V1.2 04/2017 | Battery simulator